# EAGLE design BMS_slave_Board_E14_itr2_ver3 (EAGLE 9.6.2)
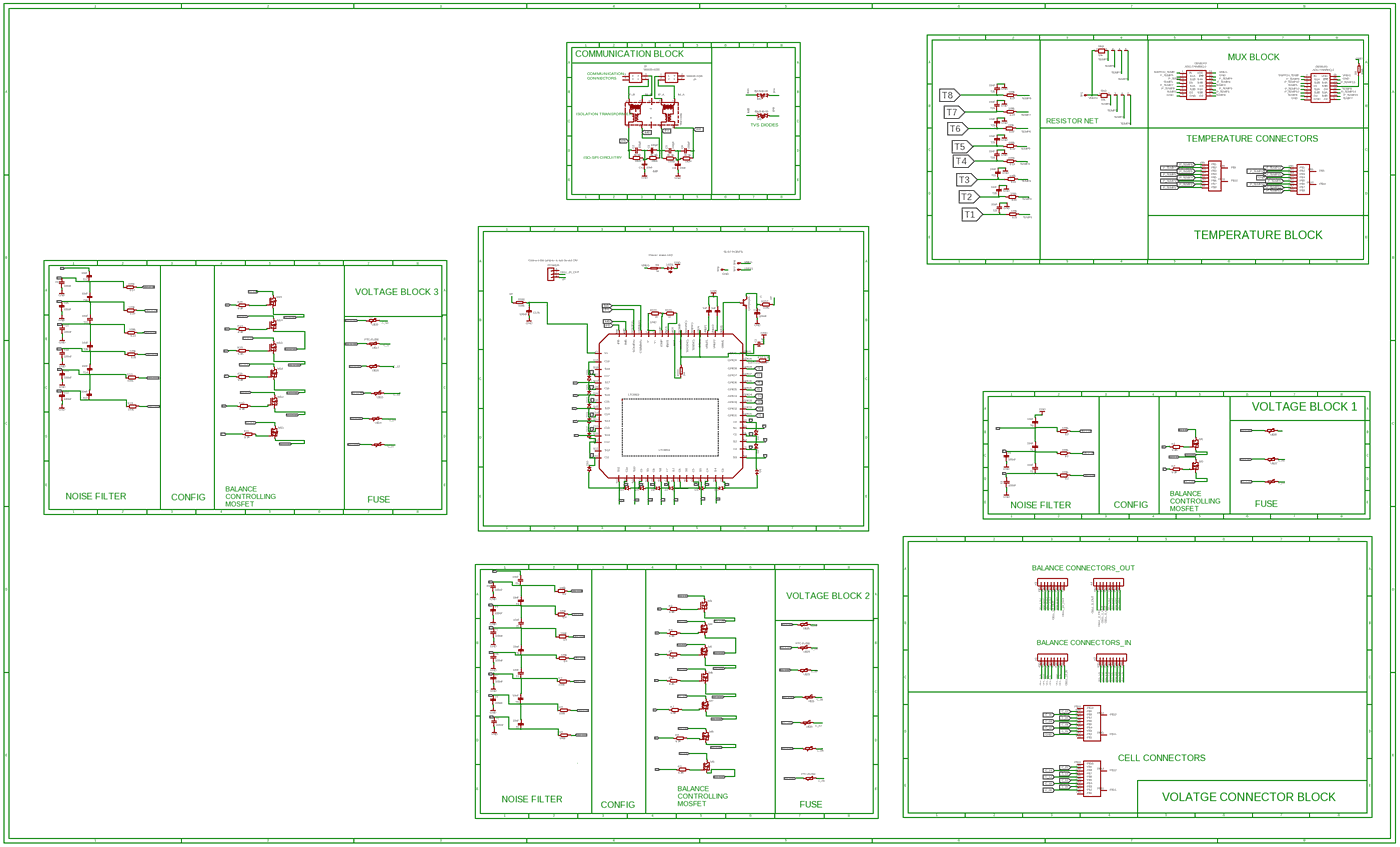
[diagram p0: schematic, sheet 1, overview]
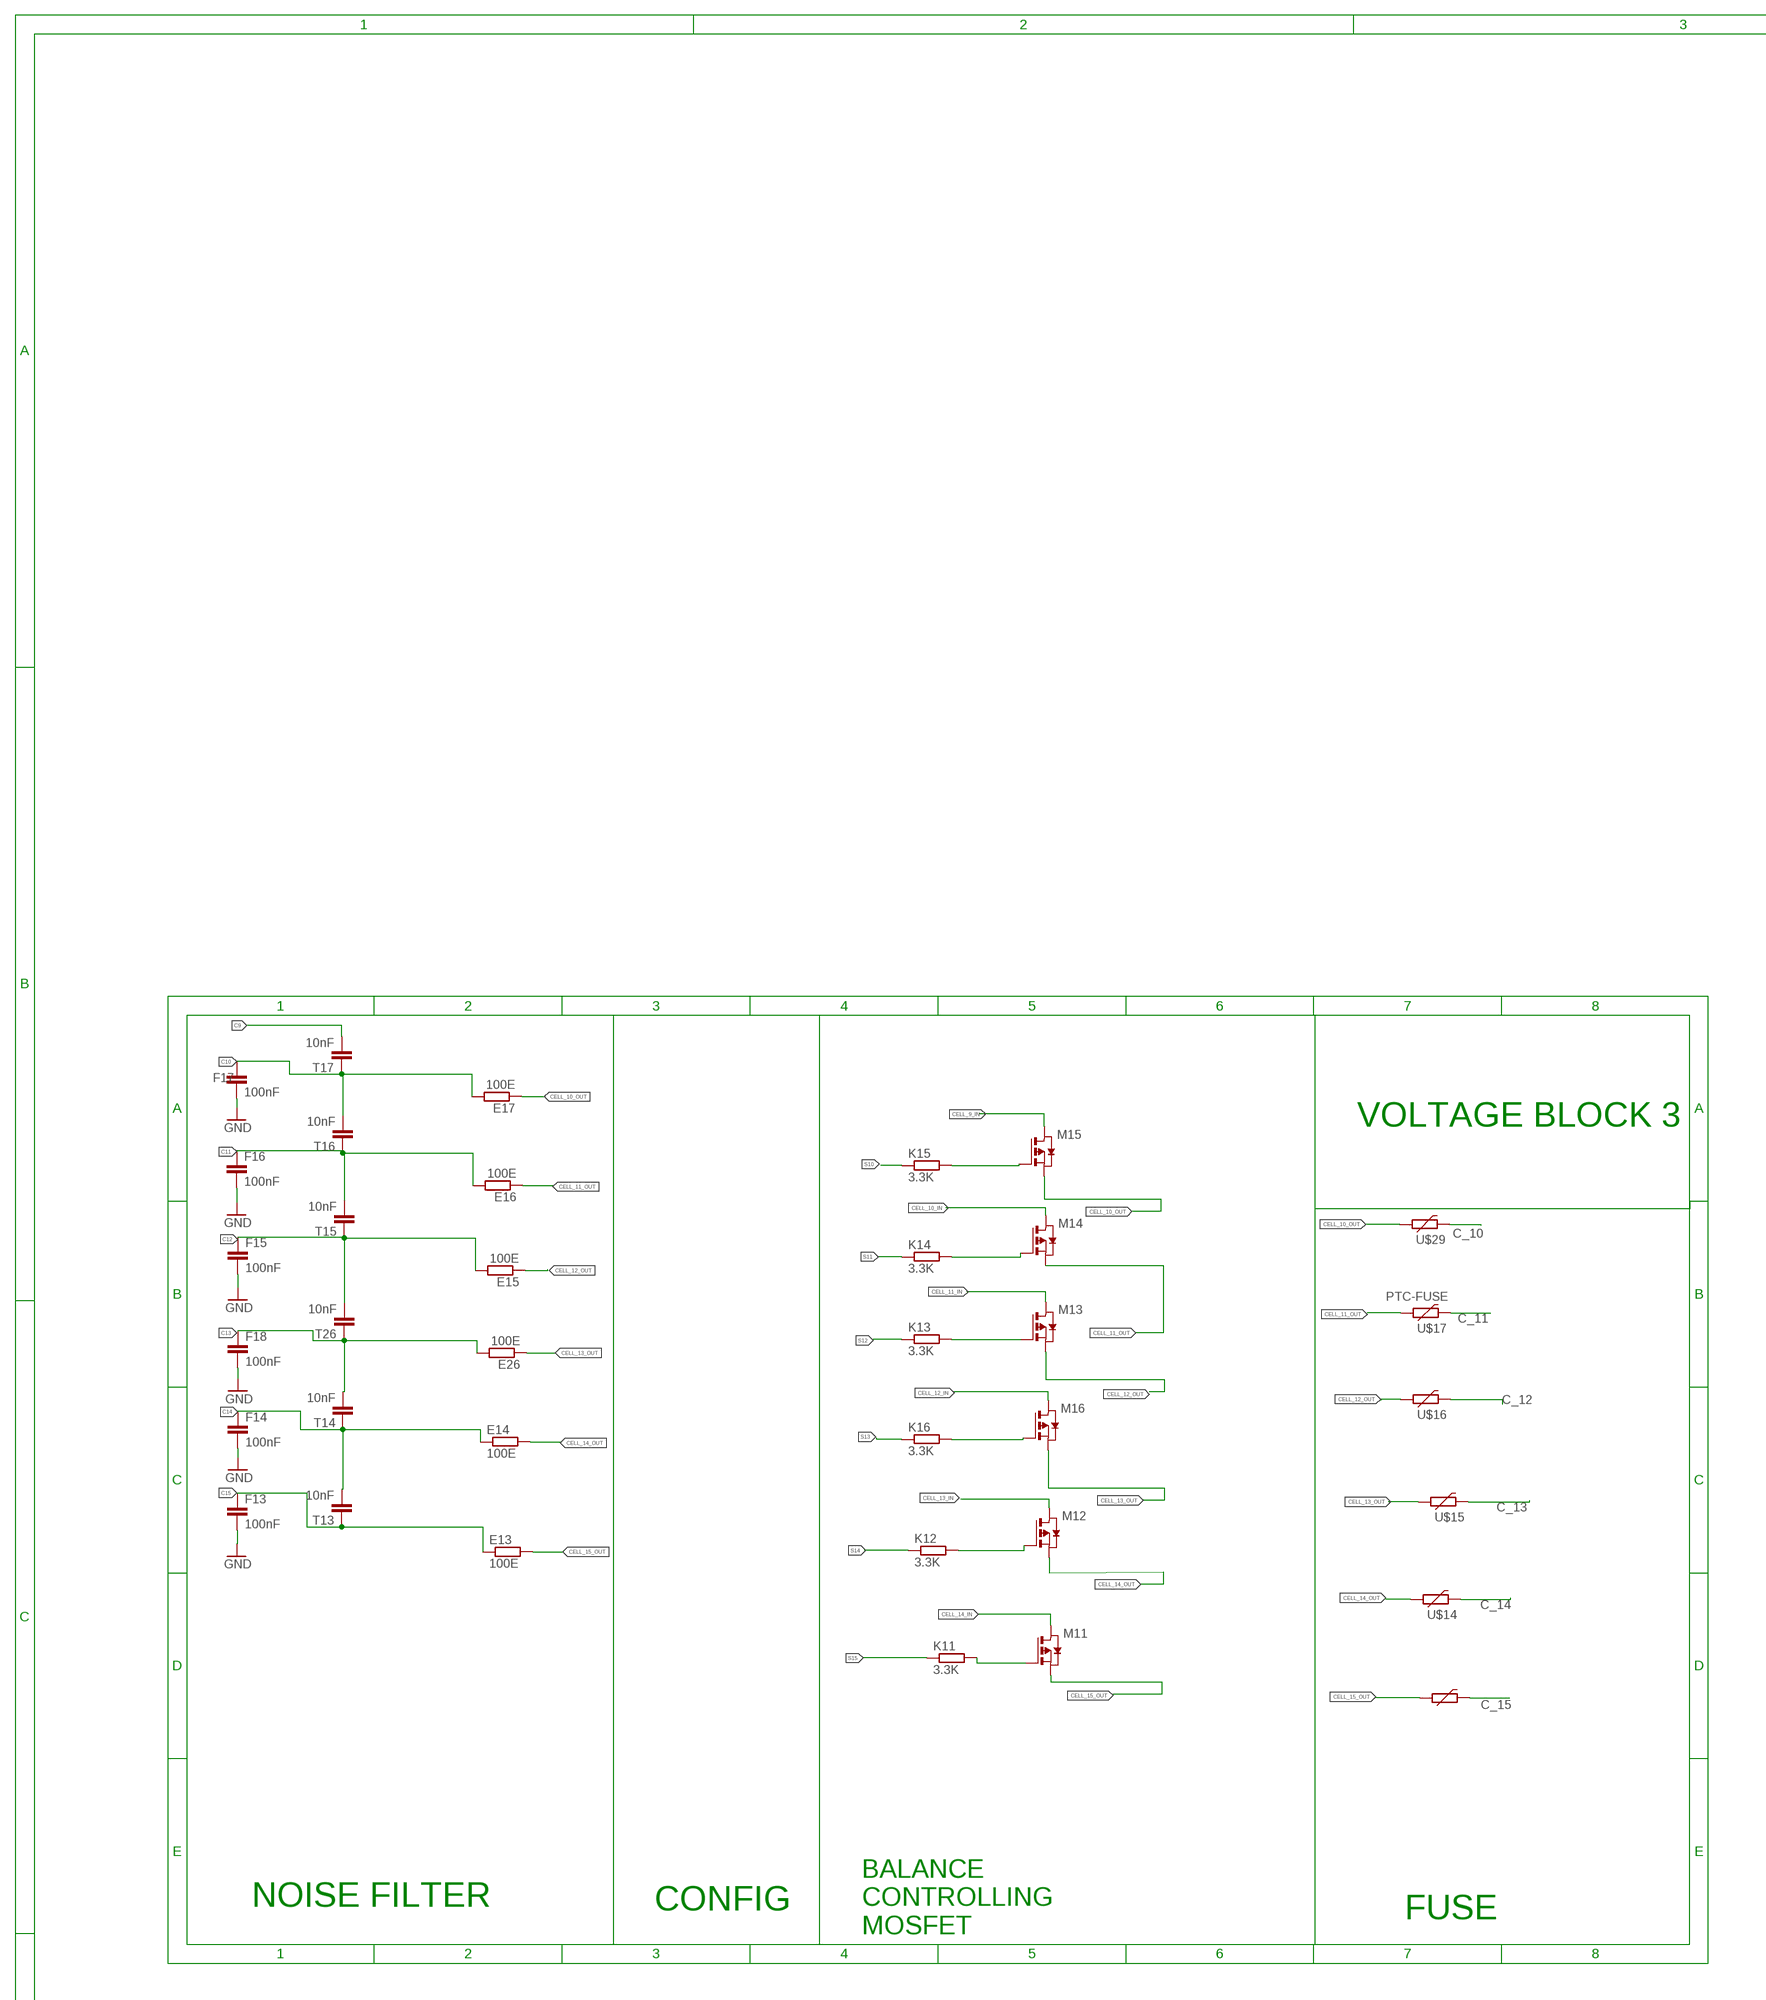
[diagram p1: schematic, sheet 1, part 1 of 6]
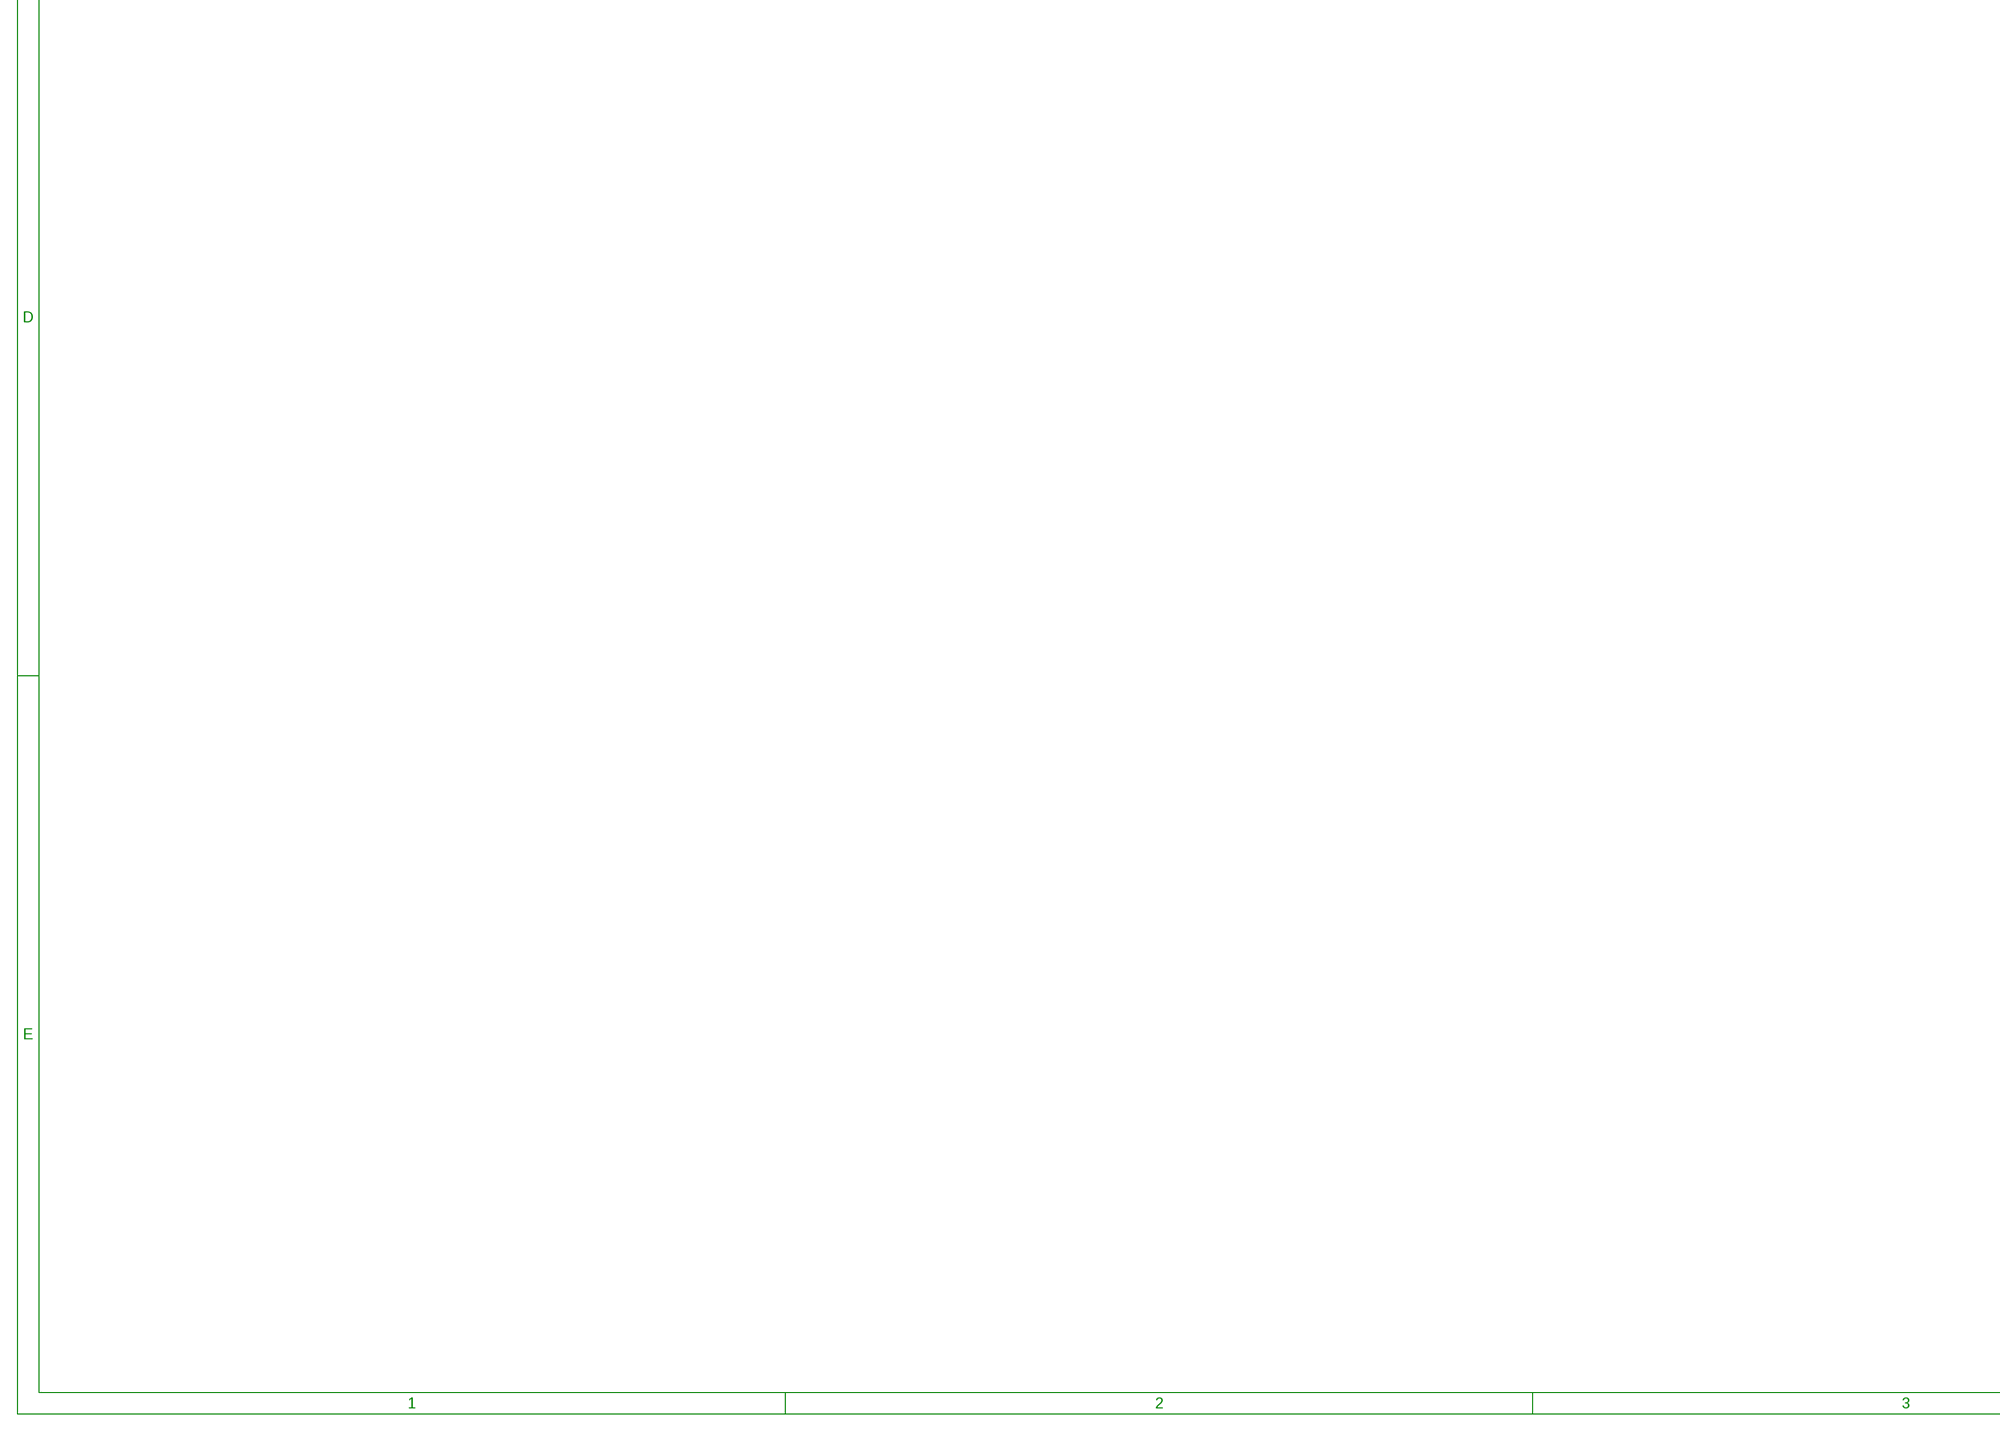
[diagram p2: schematic, sheet 1, part 2 of 6]
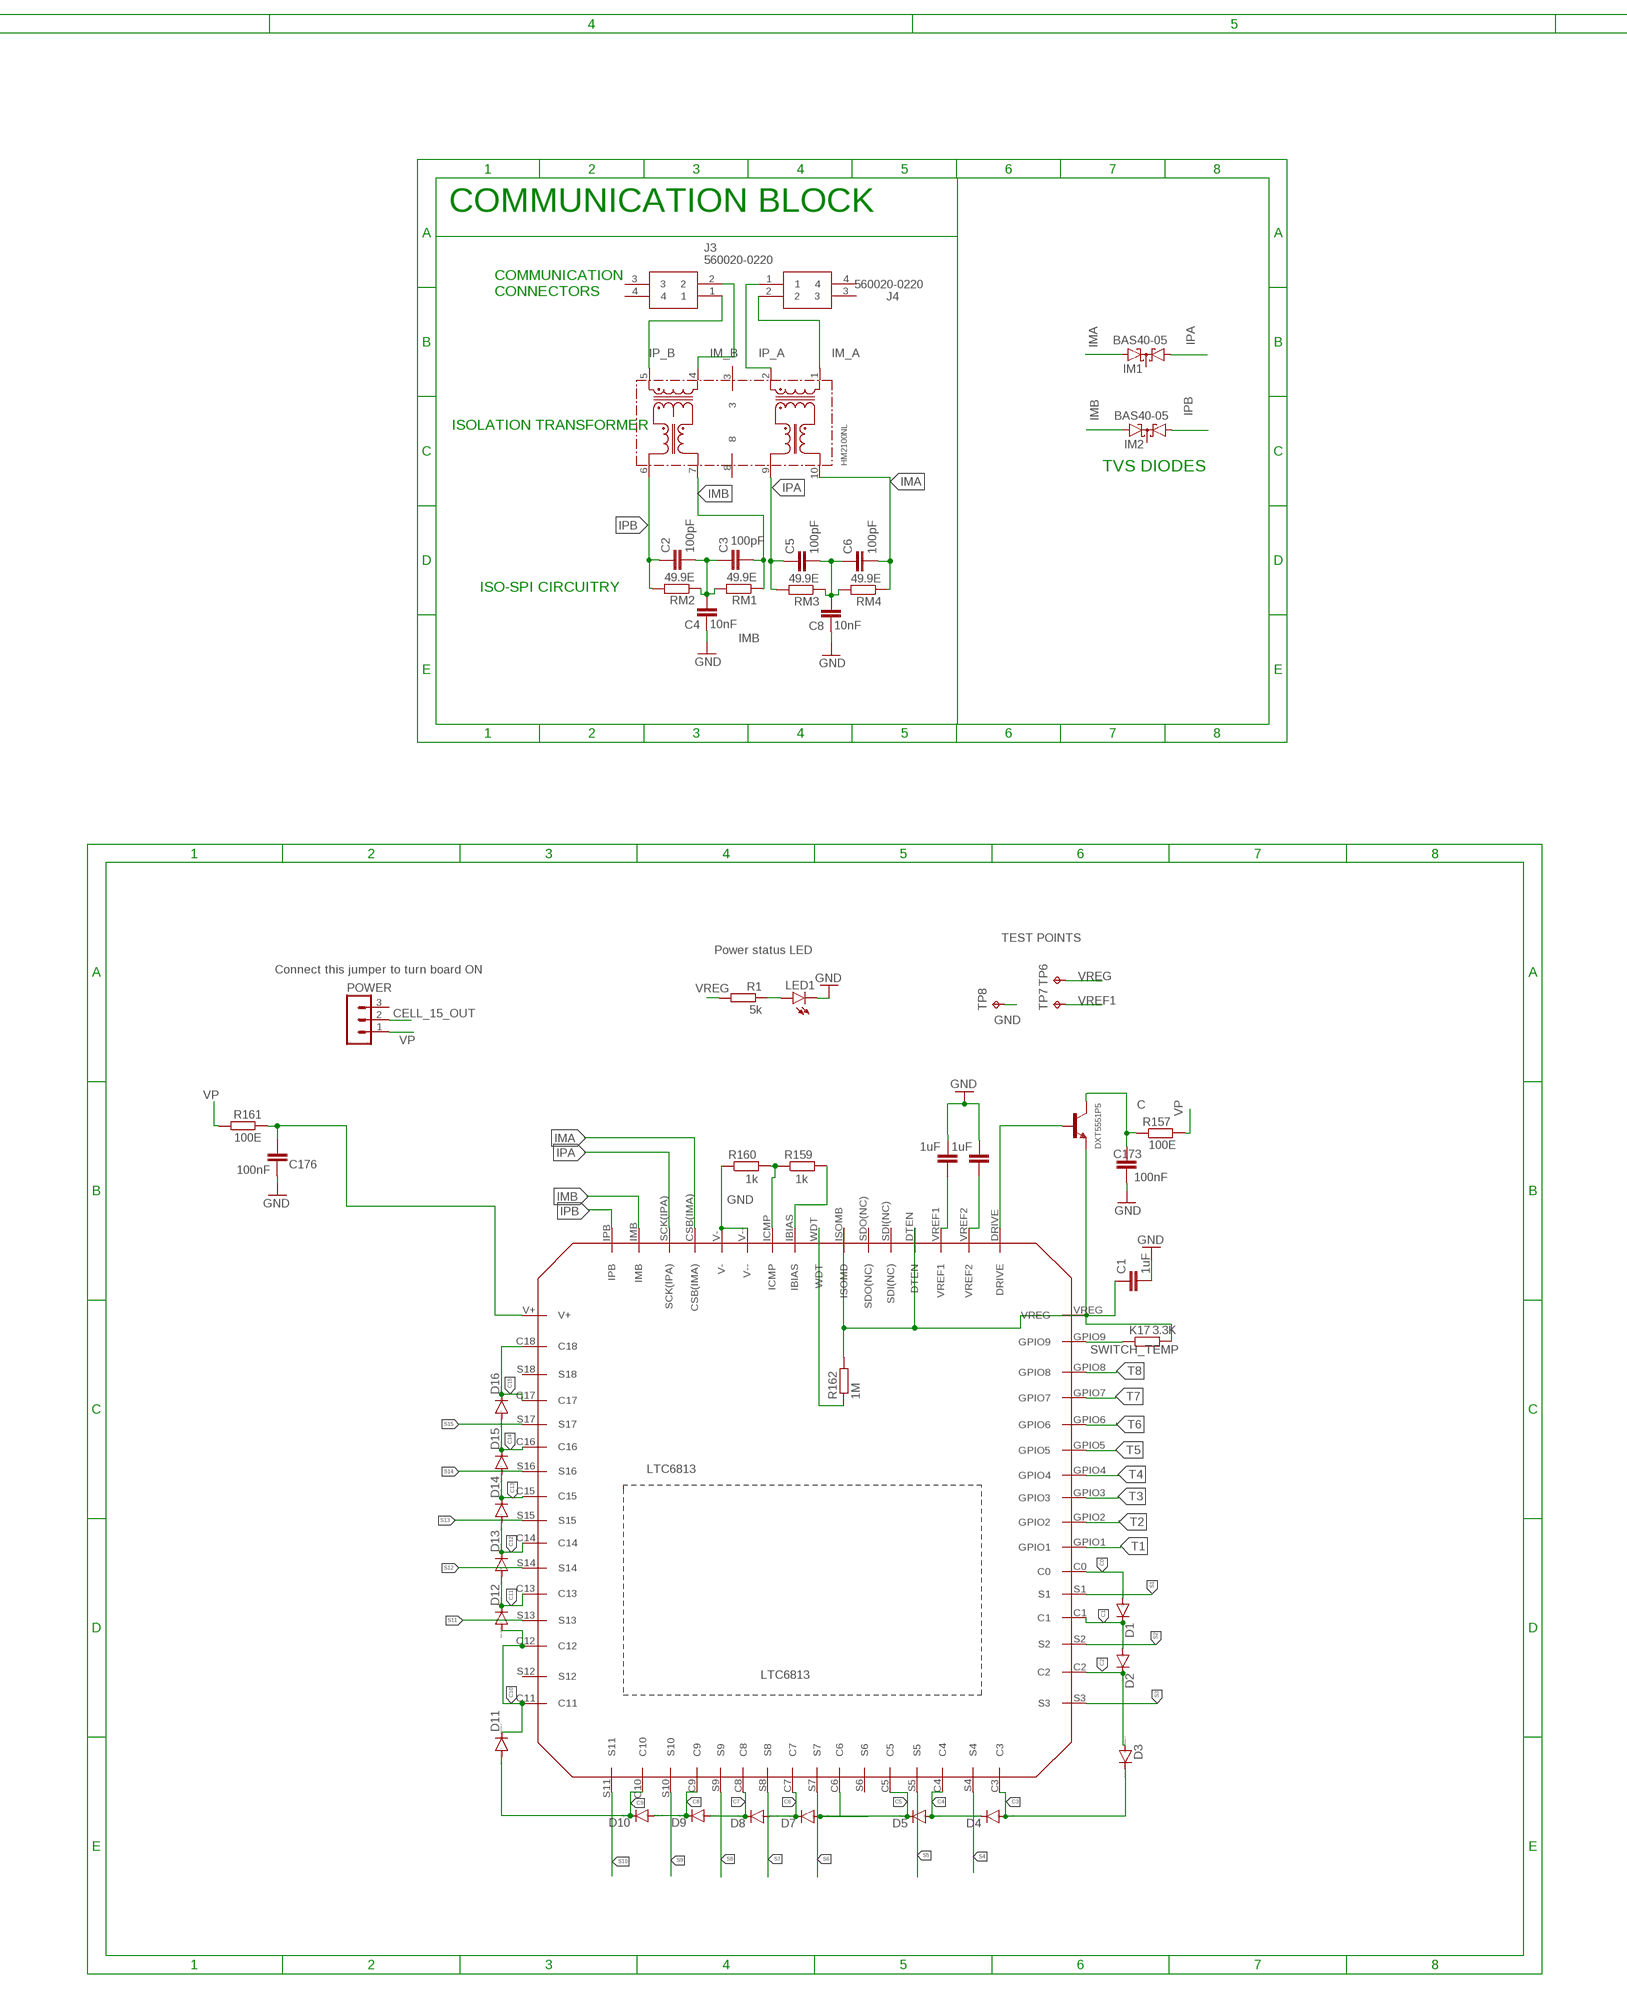
[diagram p3: schematic, sheet 1, part 3 of 6]
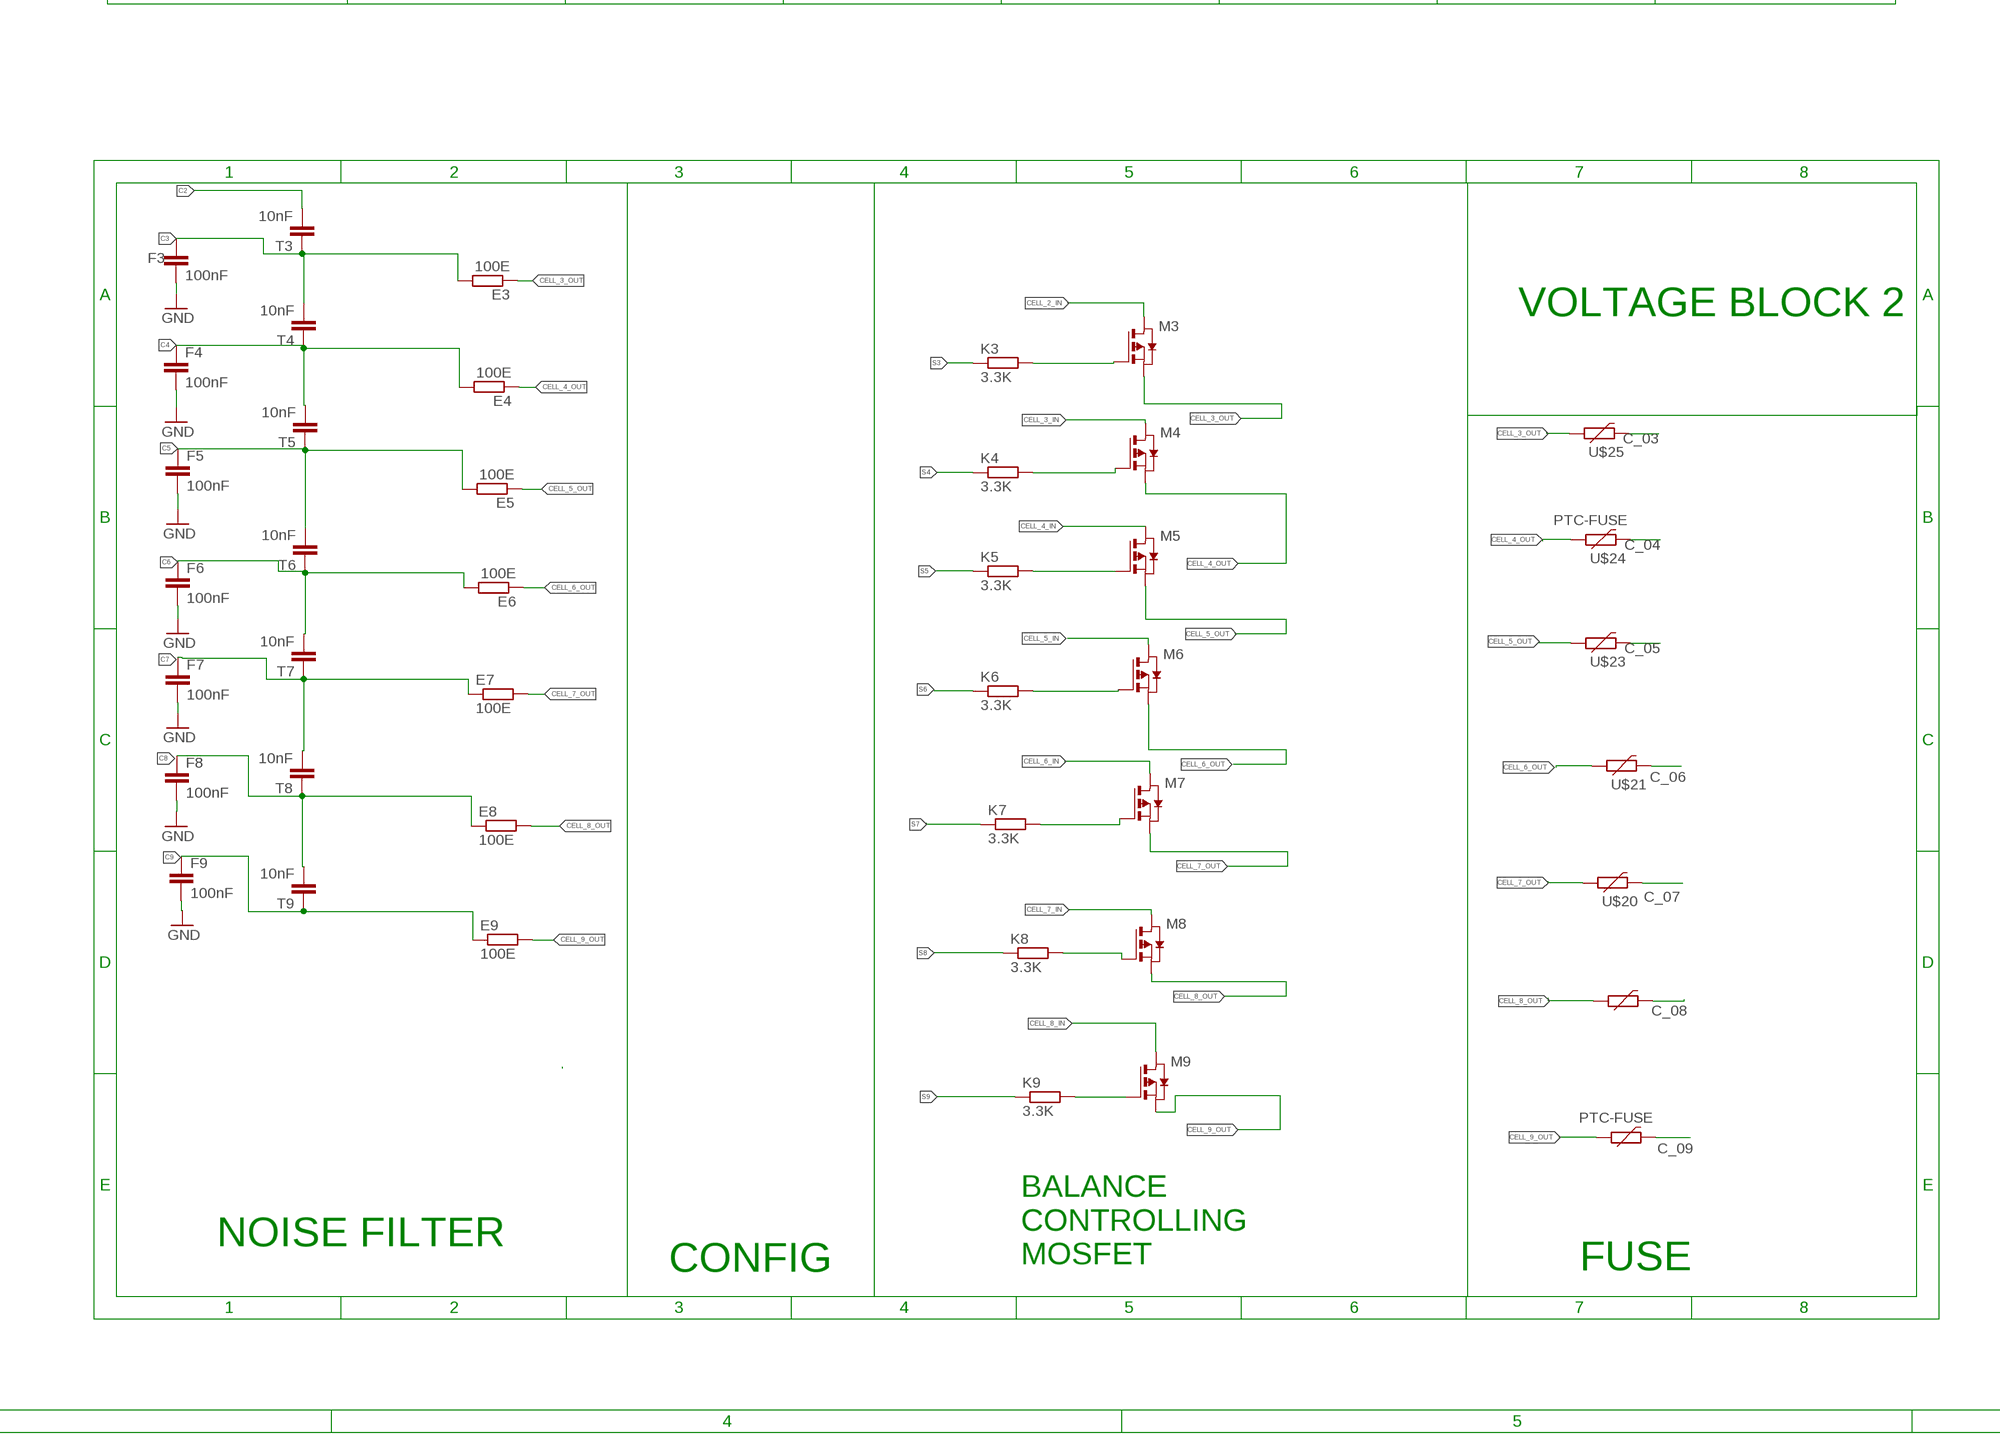
[diagram p4: schematic, sheet 1, part 4 of 6]
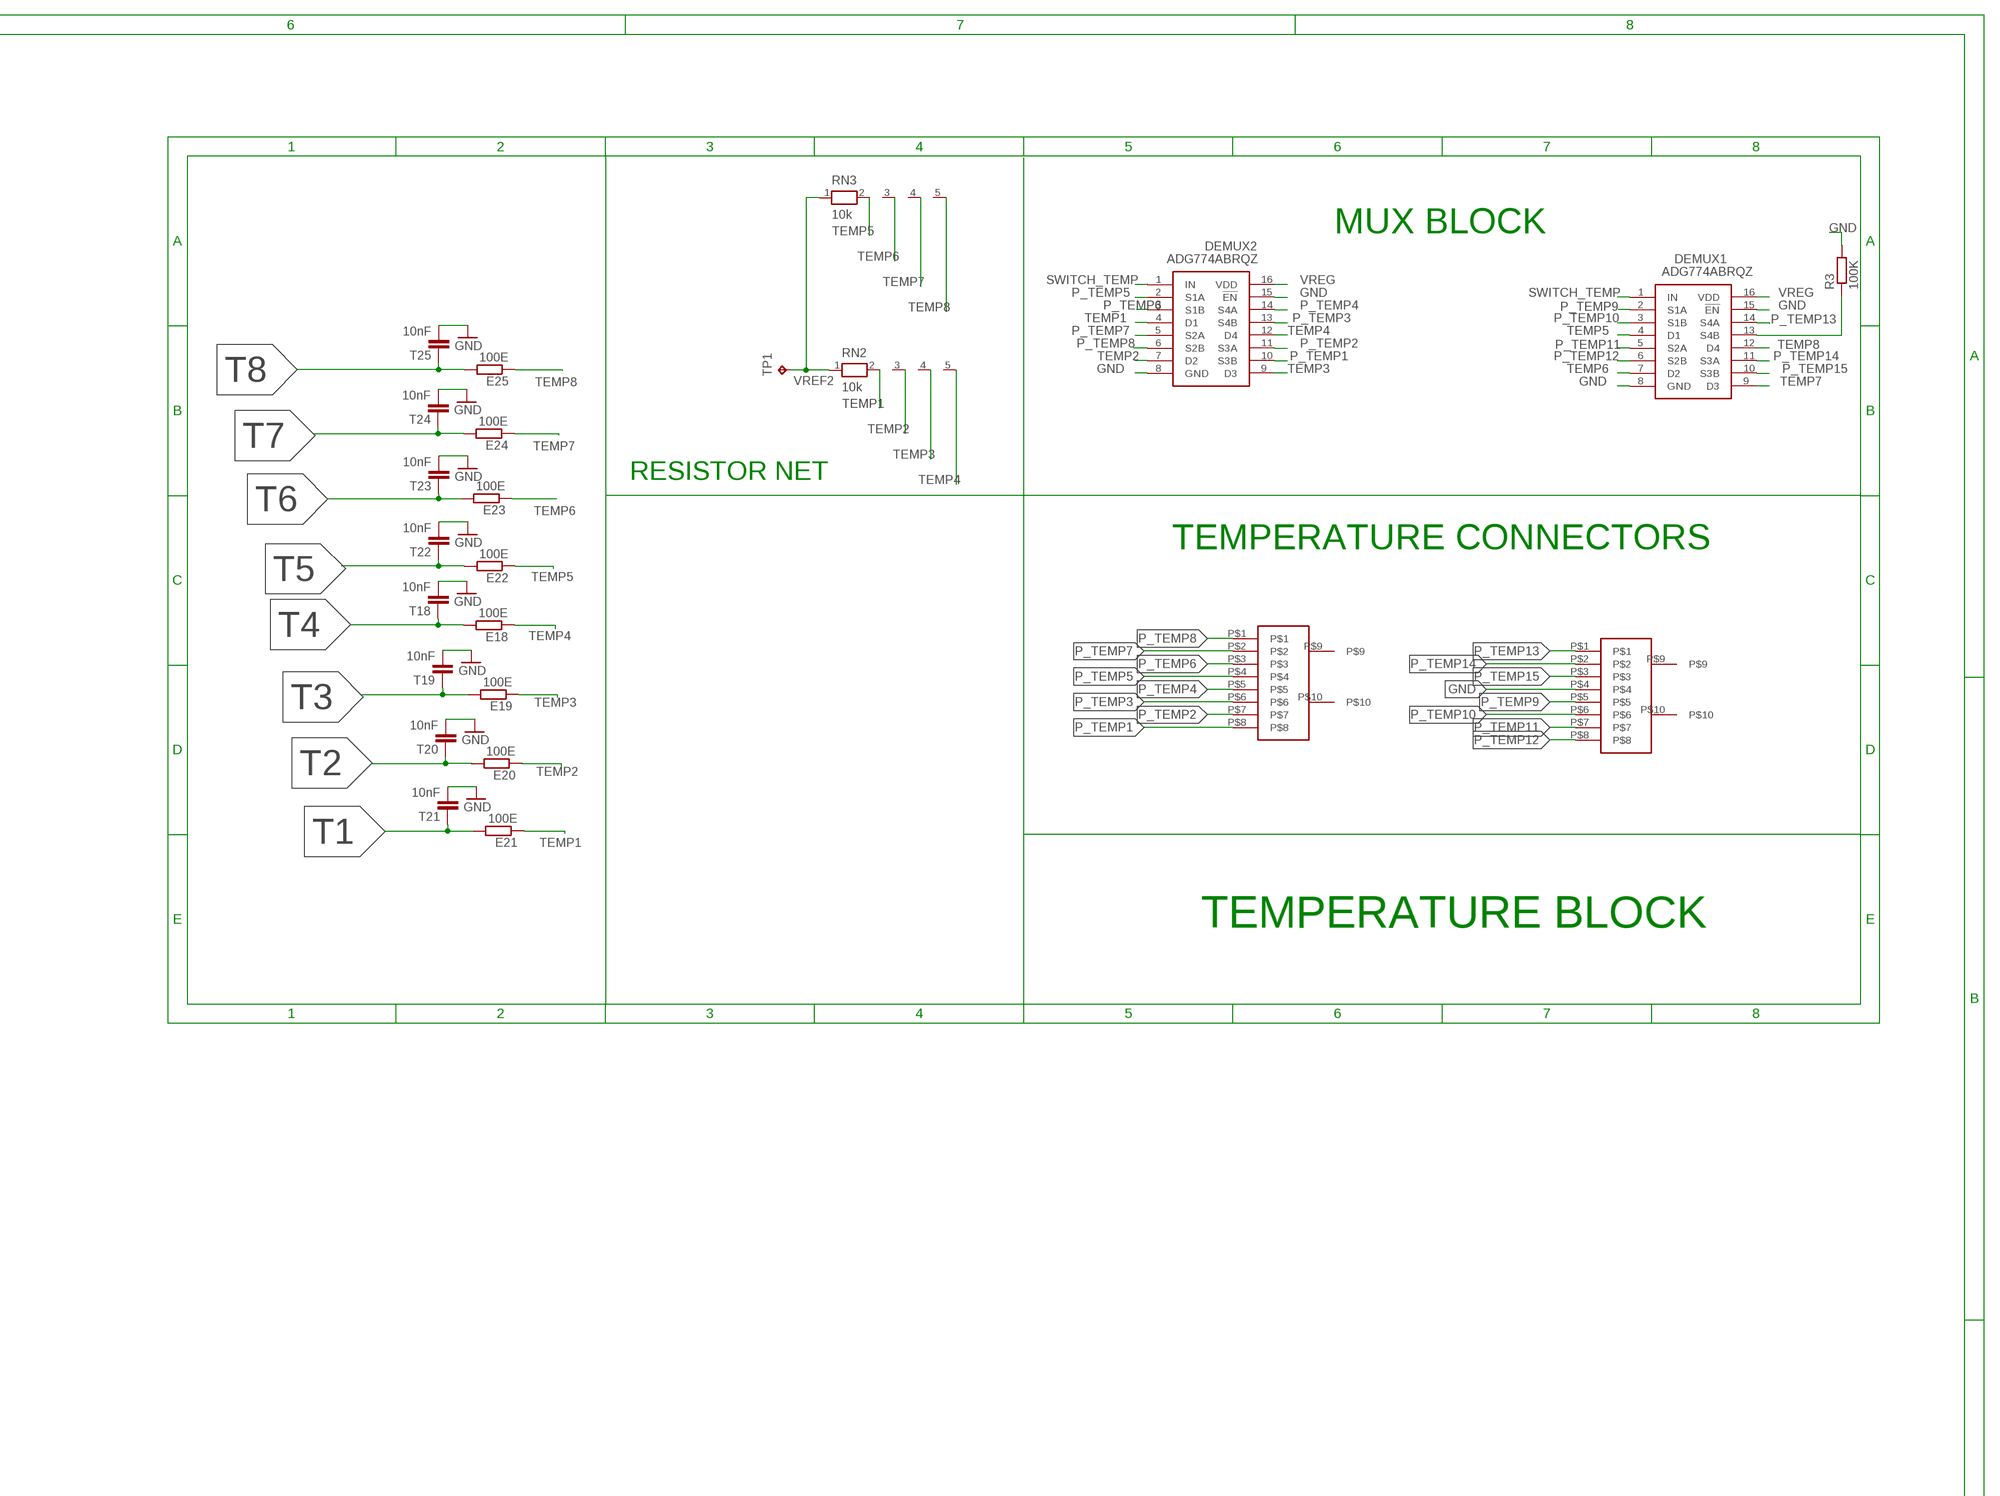
[diagram p5: schematic, sheet 1, part 5 of 6]
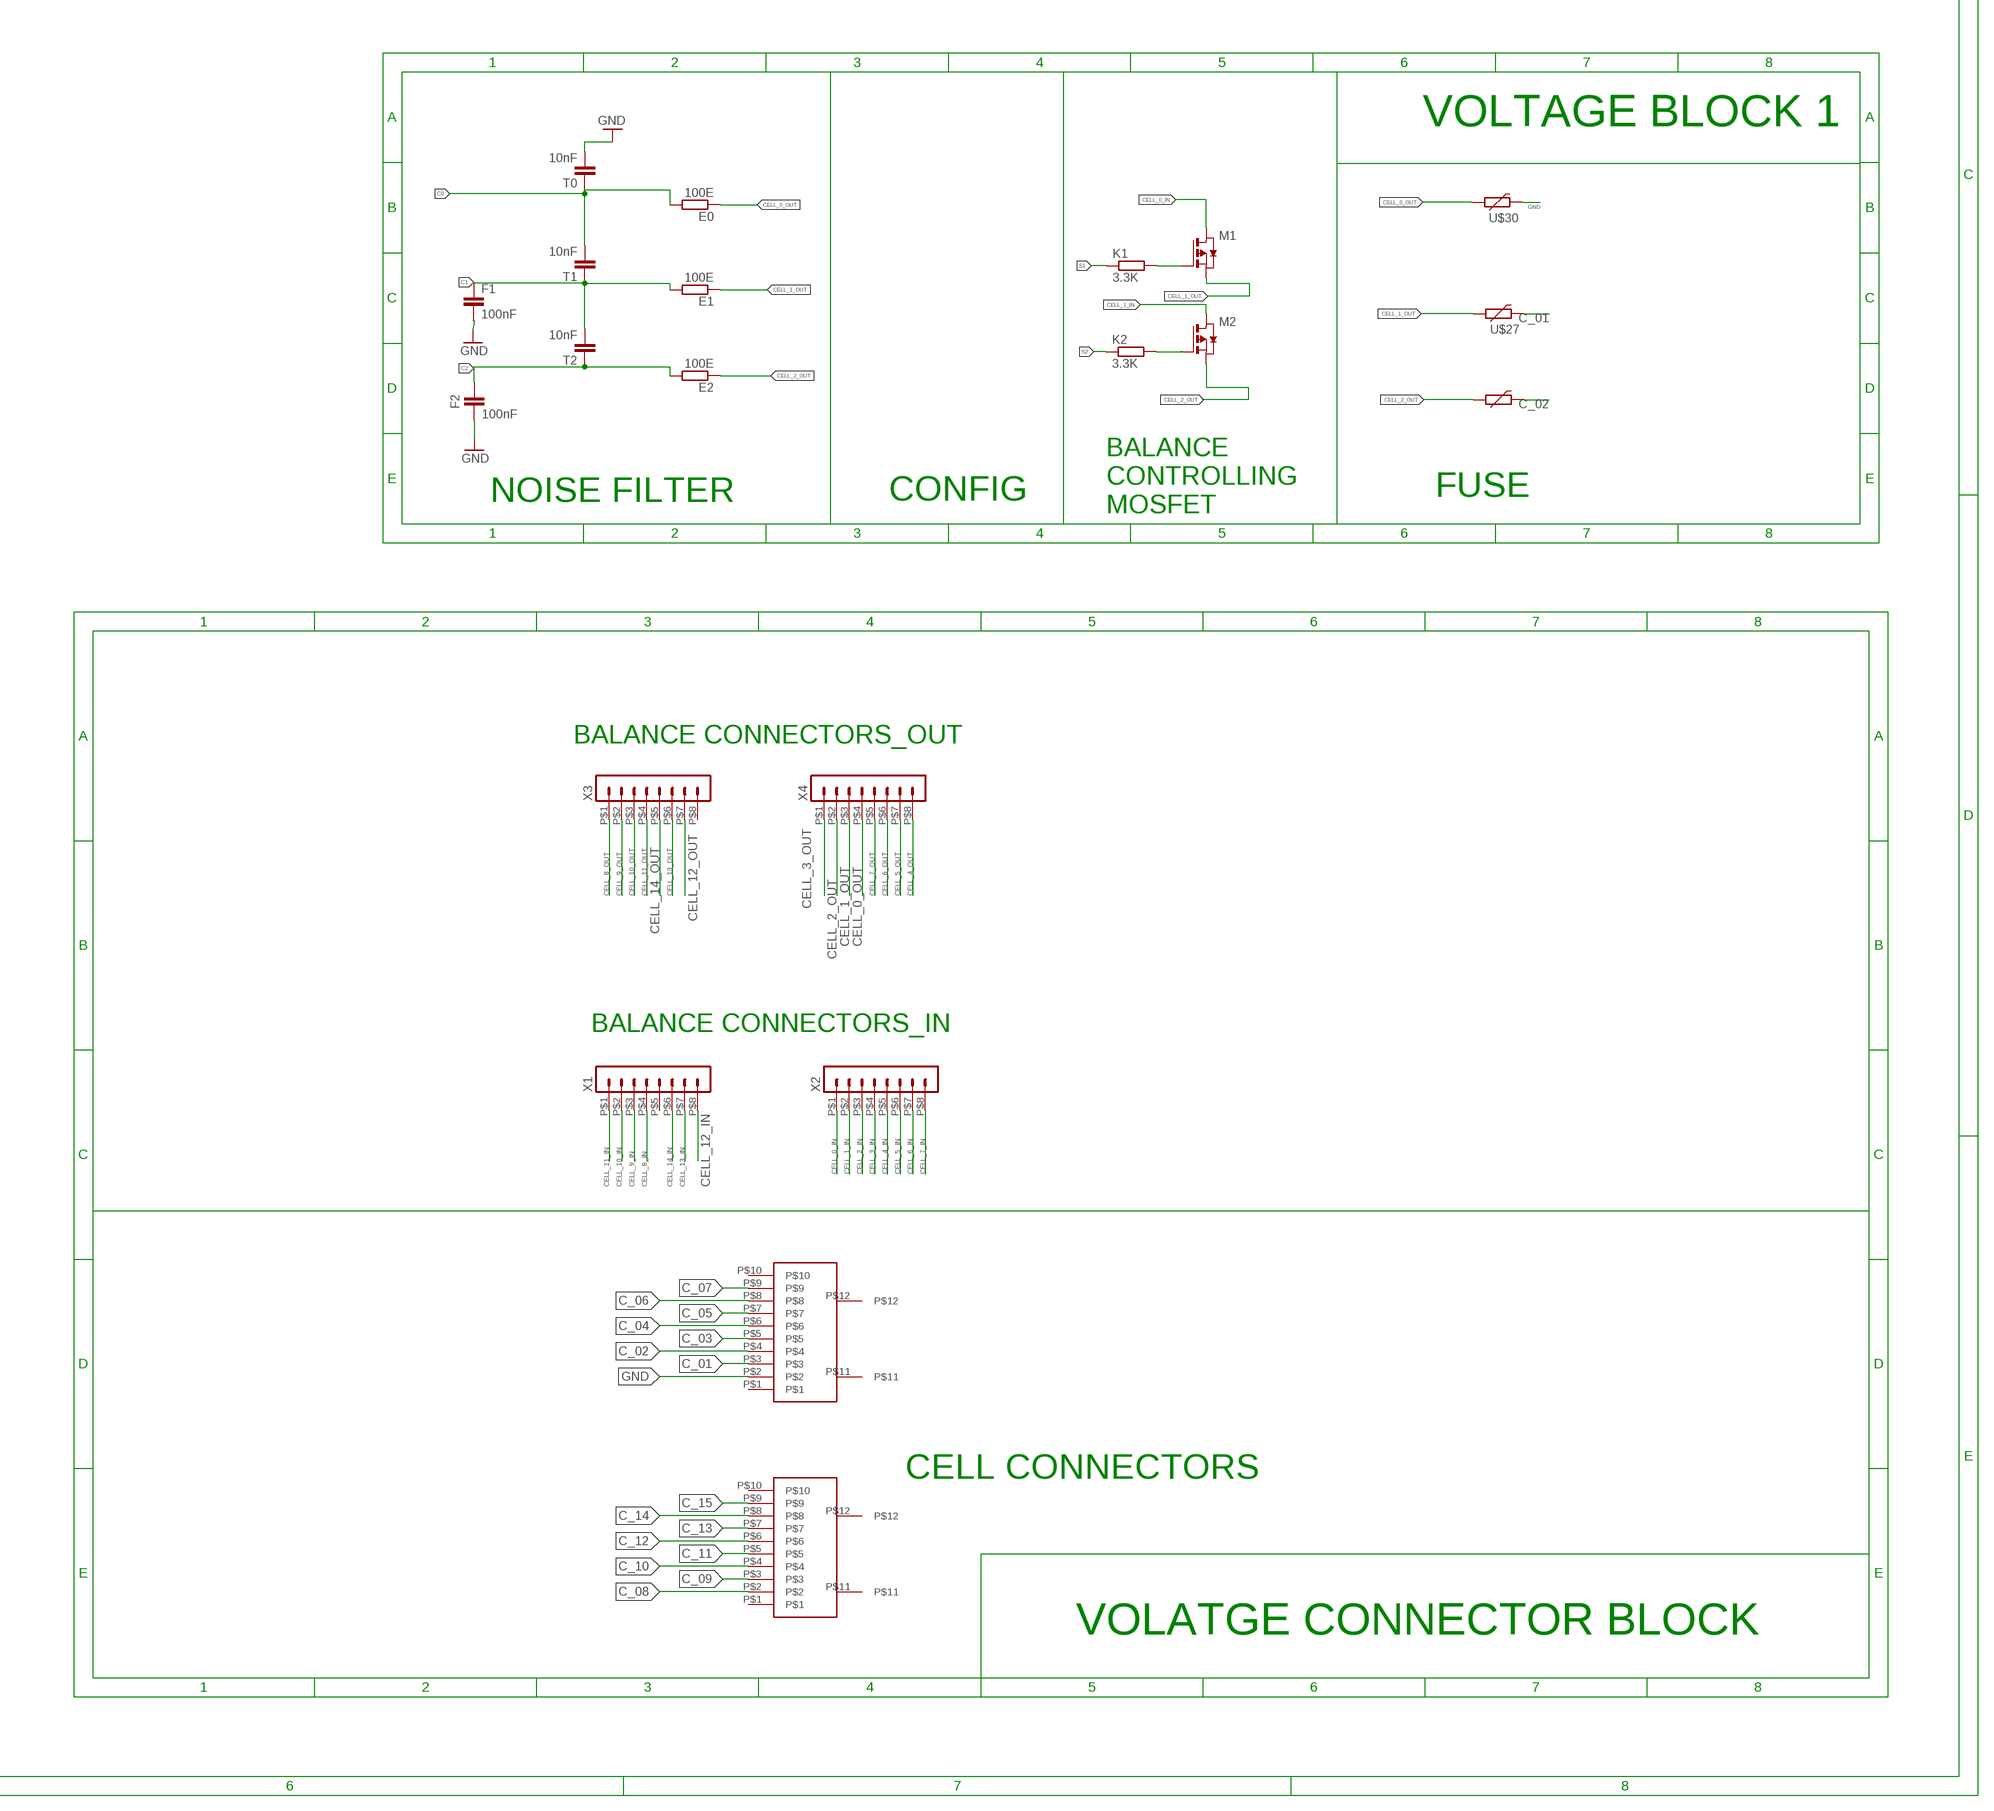
[diagram p6: schematic, sheet 1, part 6 of 6]

## Parts
C1  1uF  C-EUC0805  [C0805]
C2  100pF  C-EUC0603  [C0603]
C3  100pF  C-EUC0603  [C0603]
C4  10nF  C-EUC0603  [C0603]
C5  100pF  C-EUC0603  [C0603]
C6  100pF  C-EUC0603  [C0603]
C8  10nF  C-EUC0603  [C0603]
C173  100nF  C-EUC0805  [C0805]
C175  1uF  C-EUC0805  [C0805]
C176  100nF  C-EUC0805  [C0805]
C177  1uF  C-EUC0805  [C0805]
D1  DIODE-SOD123  [SOD123]
D2  DIODE-SOD123  [SOD123]
D3  DIODE-SOD123  [SOD123]
D4  DIODE-SOD123  [SOD123]
D5  DIODE-SOD123  [SOD123]
D7  DIODE-SOD123  [SOD123]
D8  DIODE-SOD123  [SOD123]
D9  DIODE-SOD123  [SOD123]
D10  DIODE-SOD123  [SOD123]
D11  DIODE-SOD123  [SOD123]
D12  DIODE-SOD123  [SOD123]
D13  DIODE-SOD123  [SOD123]
D14  DIODE-SOD123  [SOD123]
D15  DIODE-SOD123  [SOD123]
D16  DIODE-SOD123  [SOD123]
DEMUX1  ADG774ABRQZ  [SOP64P600X175-16N]
DEMUX2  ADG774ABRQZ  [SOP64P600X175-16N]
E0  100E  R-EU_R0603  [R0603]
E1  100E  R-EU_R0603  [R0603]
E2  100E  R-EU_R0603  [R0603]
E3  100E  R-EU_R0603  [R0603]
E4  100E  R-EU_R0603  [R0603]
E5  100E  R-EU_R0603  [R0603]
E6  100E  R-EU_R0603  [R0603]
E7  100E  R-EU_R0603  [R0603]
E8  100E  R-EU_R0603  [R0603]
E9  100E  R-EU_R0603  [R0603]
E13  100E  R-EU_R0603  [R0603]
E14  100E  R-EU_R0603  [R0603]
E15  100E  R-EU_R0603  [R0603]
E16  100E  R-EU_R0603  [R0603]
E17  100E  R-EU_R0603  [R0603]
E18  100E  R-EU_R0603  [R0603]
E19  100E  R-EU_R0603  [R0603]
E20  100E  R-EU_R0603  [R0603]
E21  100E  R-EU_R0603  [R0603]
E22  100E  R-EU_R0603  [R0603]
E23  100E  R-EU_R0603  [R0603]
E24  100E  R-EU_R0603  [R0603]
E25  100E  R-EU_R0603  [R0603]
E26  100E  R-EU_R0603  [R0603]
F1  100nF  C-EUC1206  [C1206]
F2  100nF  C-EUC1206  [C1206]
F3  100nF  C-EUC1206  [C1206]
F4  100nF  C-EUC1206  [C1206]
F5  100nF  C-EUC1206  [C1206]
F6  100nF  C-EUC1206  [C1206]
F7  100nF  C-EUC1206  [C1206]
F8  100nF  C-EUC1206  [C1206]
F9  100nF  C-EUC1206  [C1206]
F13  100nF  C-EUC1206  [C1206]
F14  100nF  C-EUC1206  [C1206]
F15  100nF  C-EUC1206  [C1206]
F16  100nF  C-EUC1206  [C1206]
F17  100nF  C-EUC1206  [C1206]
F18  100nF  C-EUC1206  [C1206]
IM1  BAS40-05  [SOT23]
IM2  BAS40-05  [SOT23]
J3  560020-0220  [5600200220]
J4  560020-0220  [5600200220]
K1  3.3K  R-EU_R0603  [R0603]
K2  3.3K  R-EU_R0603  [R0603]
K3  3.3K  R-EU_R0603  [R0603]
K4  3.3K  R-EU_R0603  [R0603]
K5  3.3K  R-EU_R0603  [R0603]
K6  3.3K  R-EU_R0603  [R0603]
K7  3.3K  R-EU_R0603  [R0603]
K8  3.3K  R-EU_R0603  [R0603]
K9  3.3K  R-EU_R0603  [R0603]
K11  3.3K  R-EU_R0603  [R0603]
K12  3.3K  R-EU_R0603  [R0603]
K13  3.3K  R-EU_R0603  [R0603]
K14  3.3K  R-EU_R0603  [R0603]
K15  3.3K  R-EU_R0603  [R0603]
K16  3.3K  R-EU_R0603  [R0603]
K17  3.3K  R-EU_R0603  [R0603]
LED1  LEDSMT1206  [1206]
M1  PMOSSOT23  [SOT-23]
M2  PMOSSOT23  [SOT-23]
M3  PMOSSOT23  [SOT-23]
M4  PMOSSOT23  [SOT-23]
M5  PMOSSOT23  [SOT-23]
M6  PMOSSOT23  [SOT-23]
M7  PMOSSOT23  [SOT-23]
M8  PMOSSOT23  [SOT-23]
M9  PMOSSOT23  [SOT-23]
M11  PMOSSOT23  [SOT-23]
M12  PMOSSOT23  [SOT-23]
M13  PMOSSOT23  [SOT-23]
M14  PMOSSOT23  [SOT-23]
M15  PMOSSOT23  [SOT-23]
M16  PMOSSOT23  [SOT-23]
POWER  MA03-1  [MA03-1]
R1  5k  R-EU_R0805  [R0805]
R3  100K  R-EU_R0805  [R0805]
R157  100E  R-EU_R0805  [R0805]
R159  1k  R-EU_R0805  [R0805]
R160  1k  R-EU_R0805  [R0805]
R161  100E  R-EU_R0805  [R0805]
R162  1M  R-EU_R0805  [R0805]
RM1  49.9E  R-EU_R0603  [R0603]
RM2  49.9E  R-EU_R0603  [R0603]
RM3  49.9E  R-EU_R0603  [R0603]
RM4  49.9E  R-EU_R0603  [R0603]
RN2  10k  RN04  [RN-5]
RN3  10k  RN04  [RN-5]
T0  10nF  C-EUC0603  [C0603]
T1  10nF  C-EUC0603  [C0603]
T2  10nF  C-EUC0603  [C0603]
T3  10nF  C-EUC0603  [C0603]
T4  10nF  C-EUC0603  [C0603]
T5  10nF  C-EUC0603  [C0603]
T6  10nF  C-EUC0603  [C0603]
T7  10nF  C-EUC0603  [C0603]
T8  10nF  C-EUC0603  [C0603]
T9  10nF  C-EUC0603  [C0603]
T13  10nF  C-EUC0603  [C0603]
T14  10nF  C-EUC0603  [C0603]
T15  10nF  C-EUC0603  [C0603]
T16  10nF  C-EUC0603  [C0603]
T17  10nF  C-EUC0603  [C0603]
T18  10nF  C-EUC0603  [C0603]
T19  10nF  C-EUC0603  [C0603]
T20  10nF  C-EUC0603  [C0603]
T21  10nF  C-EUC0603  [C0603]
T22  10nF  C-EUC0603  [C0603]
T23  10nF  C-EUC0603  [C0603]
T24  10nF  C-EUC0603  [C0603]
T25  10nF  C-EUC0603  [C0603]
T26  10nF  C-EUC0603  [C0603]
TP1  TPPAD1-13  [P1-13]
TP6  TPPAD1-13  [P1-13]
TP7  TPPAD1-13  [P1-13]
TP8  TPPAD1-13  [P1-13]
U$1  HM2100NL  [HM2100NL]
U$2  DXT5551P5  [DXT5551P5]
U$3  LTC6813  [LTC6813]
U$8  VERTICALBMS8  [VERTICALBMS8]
U$9  VERTICALBMS8  [VERTICALBMS8]
U$10  VERTICALBMS10  [VERTICALBMS10]
U$11  VERTICALBMS10  [VERTICALBMS10]
U$13  PTC-FUSE  [1206]
U$14  PTC-FUSE  [1206]
U$15  PTC-FUSE  [1206]
U$16  PTC-FUSE  [1206]
U$17  PTC-FUSE  [1206]
U$18  PTC-FUSE  [1206]
U$19  PTC-FUSE  [1206]
U$20  PTC-FUSE  [1206]
U$21  PTC-FUSE  [1206]
U$23  PTC-FUSE  [1206]
U$24  PTC-FUSE  [1206]
U$25  PTC-FUSE  [1206]
U$26  PTC-FUSE  [1206]
U$27  PTC-FUSE  [1206]
U$29  PTC-FUSE  [1206]
U$30  PTC-FUSE  [1206]
X1  HEADER_POS8_44914-0801  [44914-0801]
X2  HEADER_POS8_44914-0801  [44914-0801]
X3  HEADER_POS8_44914-0801  [44914-0801]
X4  HEADER_POS8_44914-0801  [44914-0801]

## Nets
C: C173.1 R157.1 U$2.C
C0: D1.A E0.2 T0.1 T1.2 U$3.C0
C1: D1.C D2.A E1.2 F1.1 T1.1 T2.2 U$3.C1
C2: D2.C D3.A E2.2 F2.1 T2.1 T3.2 U$3.C2
C3: D3.C D4.A E3.2 F3.1 T3.1 T4.2 U$3.C3
C4: D4.C D5.A E4.2 F4.1 T4.1 T5.2 U$3.C4
C5: D5.C D7.A E5.2 F5.1 T5.1 T6.2 U$3.C5 U$3.C6
C6: D7.C D8.A E6.2 F6.1 T6.1 T7.2 U$3.C7
C7: D8.C D9.A E7.1 F7.1 T7.1 T8.2 U$3.C8
C8: D9.C D10.A E8.1 F8.1 T8.1 T9.2 U$3.C9
C9: D10.C D11.A E9.1 F9.1 T9.1 T17.2 U$3.C10
C10: D11.C D12.A E17.2 F17.1 T16.2 T17.1 U$3.C11 U$3.C12
C11: D12.C D13.A E16.2 F16.1 T15.2 T16.1 U$3.C13
C12: D13.C D14.A E15.2 F15.1 T15.1 T26.2 U$3.C14
C13: D14.C D15.A E26.2 F18.1 T14.2 T26.1 U$3.C15
C14: D15.C D16.A E14.1 F14.1 T13.2 T14.1 U$3.C16
C15: D16.C E13.1 F13.1 T13.1 U$3.C17 U$3.C18
C_01: U$10.P$3 U$27.1
C_02: U$10.P$4 U$26.1
C_03: U$10.P$5 U$25.1
C_04: U$10.P$6 U$24.1
C_05: U$10.P$7 U$23.1
C_06: U$10.P$8 U$21.1
C_07: U$10.P$9 U$20.1
C_08: U$11.P$2 U$19.1
C_09: U$11.P$3 U$18.1
C_10: U$11.P$4 U$29.1
C_11: U$11.P$5 U$17.1
C_12: U$11.P$6 U$16.1
C_13: U$11.P$7 U$15.1
C_14: U$11.P$8 U$14.1
C_15: U$11.P$9 U$13.1
CELL_0_IN: M1.1(D) X2.P$1
CELL_0_OUT: E0.1 U$30.2 X4.P$4
CELL_1_IN: M2.1(D) X2.P$2
CELL_1_OUT: E1.1 M1.2(S) U$27.2 X4.P$3
CELL_2_IN: M3.1(D) X2.P$3
CELL_2_OUT: E2.1 M2.2(S) U$26.2 X4.P$2
CELL_3_IN: M4.1(D) X2.P$4
CELL_3_OUT: E3.1 M3.2(S) U$25.2 X4.P$1
CELL_4_IN: M5.1(D) X2.P$5
CELL_4_OUT: E4.1 M4.2(S) U$24.2 X4.P$8
CELL_5_IN: M6.1(D) X2.P$6
CELL_5_OUT: E5.1 M5.2(S) U$23.2 X4.P$7
CELL_6_IN: M7.1(D) X2.P$7
CELL_6_OUT: E6.1 M6.2(S) U$21.2 X4.P$6
CELL_7_IN: M8.1(D) X2.P$8
CELL_7_OUT: E7.2 M7.2(S) U$20.2 X4.P$5
CELL_8_IN: M9.1(D) X1.P$4
CELL_8_OUT: E8.2 M8.2(S) U$19.2 X3.P$1
CELL_9_IN: M15.1(D) X1.P$3
CELL_9_OUT: E9.2 M9.2(S) U$18.2 X3.P$2
CELL_10_IN: M14.1(D) X1.P$2
CELL_10_OUT: E17.1 M15.2(S) U$29.2 X3.P$3
CELL_11_IN: M13.1(D) X1.P$1
CELL_11_OUT: E16.1 M14.2(S) U$17.2 X3.P$4
CELL_12_IN: M16.1(D) X1.P$8
CELL_12_OUT: E15.1 M13.2(S) U$16.2 X3.P$7
CELL_13_IN: M12.1(D) X1.P$7
CELL_13_OUT: E26.1 M16.2(S) U$15.2 X3.P$6
CELL_14_IN: M11.1(D) X1.P$6
CELL_14_OUT: E14.2 M12.2(S) U$14.2 X3.P$5
CELL_15_OUT: E13.2 M11.2(S) POWER.2 U$13.2
GND: C1.2 C4.1 C8.1 C173.2 C175.2 C176.2 C177.2 DEMUX1.8(GND) DEMUX1.15(!EN) DEMUX2.8(GND) DEMUX2.15(!EN) F1.2 F2.2 F3.2 F4.2 F5.2 F6.2 F7.2 F8.2 F9.2 F13.2 F14.2 F15.2 F16.2 F17.2 F18.2 LED1.C R3.2 R160.1 T0.2 T18.2 T19.2 T20.2 T21.2 T22.2 T23.2 T24.2 T25.2 TP8.TP U$3.V- U$3.V-- U$9.P$4 U$10.P$2 U$30.1
IM_A: J4.2 U$1.1
IM_B: J3.2 U$1.4
IMA: C6.2 IM1.2(A2) RM4.1 U$1.10 U$3.CSB(IMA)
IMB: C3.2 IM2.2(A2) RM1.1 U$1.7 U$3.IMB
IP_A: J4.1 U$1.2
IP_B: J3.1 U$1.5
IPA: C5.1 IM1.1(A1) RM3.2 U$1.9 U$3.SCK(IPA)
IPB: C2.1 IM2.1(A1) RM2.2 U$1.6 U$3.IPB
N$3: C2.2 C3.1 C4.2 RM1.2 RM2.1
N$7: C5.2 C6.1 C8.2 RM3.1 RM4.2
N$8: R162.1 U$3.WDT
N$9: DEMUX1.13(S4B) R3.1
N$14: R159.1 R160.2 U$3.ICMP
N$19: K1.2 M1.3(G)
N$22: K2.2 M2.3(G)
N$25: K3.2 M3.3(G)
N$31: K4.2 M4.3(G)
N$37: K5.2 M5.3(G)
N$41: K6.2 M6.3(G)
N$43: K7.2 M7.3(G)
N$48: K16.2 M16.3(G)
N$50: K8.2 M8.3(G)
N$51: K9.2 M9.3(G)
N$63: K12.2 M12.3(G)
N$89: K15.2 M15.3(G)
N$91: K14.2 M14.3(G)
N$93: K13.2 M13.3(G)
N$95: K11.2 M11.3(G)
N$227: U$2.B U$3.DRIVE
N$241: R159.2 U$3.IBIAS
N$246: C176.1 R161.1 U$3.V+
P_TEMP1: DEMUX2.10(S3B) U$8.P$8
P_TEMP2: DEMUX2.11(S3A) U$8.P$7
P_TEMP3: DEMUX2.13(S4B) U$8.P$6
P_TEMP4: DEMUX2.14(S4A) U$8.P$5
P_TEMP5: DEMUX2.2(S1A) U$8.P$4
P_TEMP6: DEMUX2.3(S1B) U$8.P$3
P_TEMP7: DEMUX2.5(S2A) U$8.P$2
P_TEMP8: DEMUX2.6(S2B) U$8.P$1
P_TEMP9: DEMUX1.2(S1A) U$9.P$5
P_TEMP10: DEMUX1.3(S1B) U$9.P$6
P_TEMP11: DEMUX1.5(S2A) U$9.P$7
P_TEMP12: DEMUX1.6(S2B) U$9.P$8
P_TEMP13: DEMUX1.14(S4A) U$9.P$1
P_TEMP14: DEMUX1.11(S3A) U$9.P$2
P_TEMP15: DEMUX1.10(S3B) U$9.P$3
R: LED1.A R1.1
S1: K1.1 U$3.S1
S2: K2.1 U$3.S2
S3: K3.1 U$3.S3
S4: K4.1 U$3.S4
S5: K5.1 U$3.S5
S6: K6.1 U$3.S7
S7: K7.1 U$3.S8
S8: K8.1 U$3.S9
S9: K9.1 U$3.S10
S10: K15.1 U$3.S11
S11: K14.1 U$3.S13
S12: K13.1 U$3.S14
S13: K16.1 U$3.S15
S14: K12.1 U$3.S16
S15: K11.1 U$3.S17
SWITCH_TEMP: DEMUX1.1(IN) DEMUX2.1(IN) K17.1 U$3.GPIO9
T1: E21.2 T21.1 U$3.GPIO1
T2: E20.2 T20.1 U$3.GPIO2
T3: E19.2 T19.1 U$3.GPIO3
T4: E18.2 T18.1 U$3.GPIO4
T5: E22.2 T22.1 U$3.GPIO5
T6: E23.2 T23.1 U$3.GPIO6
T7: E24.2 T24.1 U$3.GPIO7
T8: E25.2 T25.1 U$3.GPIO8
TEMP1: DEMUX2.4(D1) E21.1 RN2.2
TEMP2: DEMUX2.7(D2) E20.1 RN2.3
TEMP3: DEMUX2.9(D3) E19.1 RN2.4
TEMP4: DEMUX2.12(D4) E18.1 RN2.5
TEMP5: DEMUX1.4(D1) E22.1 RN3.2
TEMP6: DEMUX1.7(D2) E23.1 RN3.3
TEMP7: DEMUX1.9(D3) E24.1 RN3.4
TEMP8: DEMUX1.12(D4) E25.1 RN3.5
VP: POWER.1 R157.2 R161.2
VREF1: C175.1 TP7.TP U$3.VREF1
VREF2: C177.1 RN2.1 RN3.1 TP1.TP U$3.VREF2
VREG: C1.1 DEMUX1.16(VDD) DEMUX2.16(VDD) K17.2 R1.2 R162.2 TP6.TP U$2.E U$3.DTEN U$3.ISOMB(ISOMD) U$3.VREG
Unconnected: IM1.3(C) IM2.3(C) J3.3 J3.4 J4.3 J4.4 POWER.3 U$1.3 U$1.8 U$3.S6 U$3.S12 U$3.S18 U$3.SDI(NC) U$3.SDO(NC) U$8.P$9 U$8.P$10 U$9.P$9 U$9.P$10 U$10.P$1 U$10.P$10 U$10.P$11 U$10.P$12 U$11.P$1 U$11.P$10 U$11.P$11 U$11.P$12 X1.P$5 X3.P$8

## Notes on the sheet
- COMMUNICATION BLOCK
- MUX BLOCK
- COMMUNICATION
  CONNECTORS
- ISOLATION TRANSFORMER
- RESISTOR NET
- TVS DIODES
- TEMPERATURE CONNECTORS
- ISO-SPI CIRCUITRY
- TEMPERATURE BLOCK
- TEST POINTS
- Power status LED
- Connect this jumper to turn board ON
- VOLTAGE BLOCK 3
- VOLTAGE BLOCK 1
- NOISE FILTER | CONFIG
- FUSE
- BALANCE
  CONTROLLING
  MOSFET
- NOISE FILTER | CONFIG | FUSE
- BALANCE
  CONTROLLING
  MOSFET
- BALANCE CONNECTORS_OUT
- VOLTAGE BLOCK 2
- BALANCE CONNECTORS_IN
- CELL CONNECTORS
- NOISE FILTER | VOLATGE CONNECTOR BLOCK
- BALANCE
  CONTROLLING
  MOSFET
- CONFIG | FUSE

## Library data of the parts
C1 C173 C175-C177 = IIT_BOMBAY_Racing:C-EU: CAPACITOR, European symbol
C2-C6 C8 T0 T1-T9 T13-T26 = resistor:C-EU: CAPACITOR, European symbol; MID: GCD188R71H103KA01D
D1-D5 D7-D16 = diode:DIODE-: DIODE
DEMUX1 DEMUX2 = SamacSys_Parts:ADG774ABRQZ: ADG774ABRQZ analogue switch, QSOP16 Analog Devices ADG774ABRQZ, Analogue Switch Quad 2:1, 3.3 V, 5 V, 16-Pin QSOP Source: Datasheet <http://www.analog.com/media/en/technical-documentation/data-sheets/ADG774A.pdf>; DESCRIPTION: ADG774ABRQZ analogue switch, QSOP16 Analog Devices ADG774ABRQZ, Analogue Switch Quad 2:1, 3.3 V, 5 V, 16-Pin QSOP; HEIGHT: 1.75mm; MANUFACTURER_NAME: Analog Devices; MANUFACTURER_PART_NUMBER: ADG774ABRQZ; MOUSER_PART_NUMBER: 584-ADG774ABRQZ; MOUSER_PRICE-STOCK: https://www.mouser.co.uk/ProductDetail/Analog-Devices/ADG774ABRQZ?qs=BpaRKvA4VqET7XGcXCMwIA%3D%3D
E0 E1-E9 E13-E26 = resistor:R-EU_: RESISTOR, European symbol; MID: MCT06030C1000FP500
F1-F9 F13-F18 = rcl:C-EU: CAPACITOR, European symbol; SPICEPREFIX: C
IM1 IM2 = diode:BAS40-05: Silicon Schottky Diodes General-purpose diode for high-speed switching
J3 J4 = 560020-0220:560020-0220: MOLEX - 560020-0220 - CONNECTOR, HEADER, 2POS, 1ROW, 2MM Source: Datasheet <https://www.molex.com/pdm_docs/sd/5600200220_sd.pdf>; DESCRIPTION: MOLEX - 560020-0220 - CONNECTOR, HEADER, 2POS, 1ROW, 2MM; HEIGHT: 8mm; MANUFACTURER_NAME: Molex; MANUFACTURER_PART_NUMBER: 560020-0220; MOUSER_PART_NUMBER: 538-560020-0220; MOUSER_PRICE-STOCK: https://www.mouser.co.uk/ProductDetail/Molex/560020-0220?qs=4r2B00tbnb2Q0zW%252Bilmyag%3D%3D
K1-K9 K11-K17 = resistor:R-EU_: RESISTOR, European symbol; MID: CRCW06033K30FKEB
LED1 = led:LED: LED OSRAM: - CHIPLED LG R971, LG N971, LY N971, LG Q971, LY Q971, LO R971, LY R971 LH N974, LH R974 LS Q976, LO Q976, LY Q976 LO Q996 - Hyper CHIPLED LW Q18S LB Q993, LB Q99A, LB R99A - SideLED LS A670, LO A670, LY A670, LG A670, LP A670 LB A673, LV A673, LT A673, LW A673 LH A674 LY A675 LS A676, LA A676, LO A676, LY A676, LW A676 LS A679, LY A679, LG A679 - Hyper Micro SIDELED® LS Y876, LA Y876, LO Y876, LY Y876 LT Y87S - SmartLED LW L88C, LW L88S LB L89C, LB L89S, LG L890 LS L89K, LO L89K, LY L89K LS L896, LA L896, LO L896, LY L896 - TOPLED LS T670, LO T670, LY T670, LG T670, LP T670 LSG T670, LSP T670, LSY T670, LOP T670, LYG T670 LG T671, LOG T671, LSG T671 LB T673, LV T673, LT T673, LW T673 LH T674 LS T676, LA T676, LO T676, LY T676, LB T676, LH T676, LSB T676, LW T676 LB T67C, LV T67C, LT T67C, LS T67K, LO T67K, LY T67K, LW E67C LS E67B, LA E67B, LO E67B, LY E67B, LB E67C, LV E67C, LT E67C LW T67C LS T679, LY T679, LG T679 LS T770, LO T770, LY T770, LG T770, LP T770 LB T773, LV T773, LT T773, LW T773 LH T774 LS E675, LA E675, LY E675, LS T675 LS T776, LA T776, LO T776, LY T776, LB T776 LHGB T686 LT T68C, LB T68C - Hyper Mini TOPLED® LB M676 - Mini TOPLED Santana® LG M470 LS M47K, LO M47K, LY M47K Source: http://www.osram.convergy.de LUXEON: - LUMILED® LXK2-PW12-R00, LXK2-PW12-S00, LXK2-PW14-U00, LXK2-PW14-V00 LXK2-PM12-R00, LXK2-PM12-S00, LXK2-PM14-U00 LXK2-PE12-Q00, LXK2-PE12-R00, LXK2-PE12-S00, LXK2-PE14-T00, LXK2-PE14-U00 LXK2-PB12-K00, LXK2-PB12-L00, LXK2-PB12-M00, LXK2-PB14-N00, LXK2-PB14-P00, LXK2-PB14-Q00 LXK2-PR12-L00, LXK2-PR12-M00, LXK2-PR14-Q00, LXK2-PR14-R00 LXK2-PD12-Q00, LXK2-PD12-R00, LXK2-PD12-S00 LXK2-PH12-R00, LXK2-PH12-S00 LXK2-PL12-P00, LXK2-PL12-Q00, LXK2-PL12-R00 Source: www.luxeon.com KINGBRIGHT: KA-3528ASYC Source: www.kingbright.com
M1-M9 M11-M16 = zetex:PMOSSOT23: MOS FET; MID: BSS308PEH6327XT; OC_FARNELL: unknown; OC_NEWARK: unknown
POWER = con-lstb:MA03-1: PIN HEADER; OC_FARNELL: unknown; OC_NEWARK: unknown
R1 R157 R159-R162 = IIT_BOMBAY_Racing:R-EU_: RESISTOR, European symbol
R3 = rcl:R-EU_: RESISTOR, European symbol; SPICEPREFIX: R
RM1-RM4 = resistor:R-EU_: RESISTOR, European symbol; MID: CRCW0603120RFKEAHP
RN2 RN3 = resistor-net:RN04: RESISTOR NETWORK; MID: 4605X-101-103LF; OC_FARNELL: unknown; OC_NEWARK: unknown
TP1 TP6-TP8 = testpad:TP: Test pad
U$1 = HM2100NL:HM2100NL
U$2 = DXT5551P5:DXT5551P5
U$3 = 6813:LTC6813
U$8 U$9 = IIT_BOMBAY_Racing2:VERTICALBMS8
U$10 U$11 = IIT_BOMBAY_Racing2:VERTICALBMS10
U$13-U$21 U$23-U$27 U$29 U$30 = IIT_BOMBAY_Racing:PTC-FUSE; MID: 0466.200NRHF
X1-X4 = IIT_BOMBAY_Racing:HEADER_POS8_?: Molex - Micro-Fit 3.0 Series connector, 3.00mm (0.118") pitch header, 8 positions.

## Board
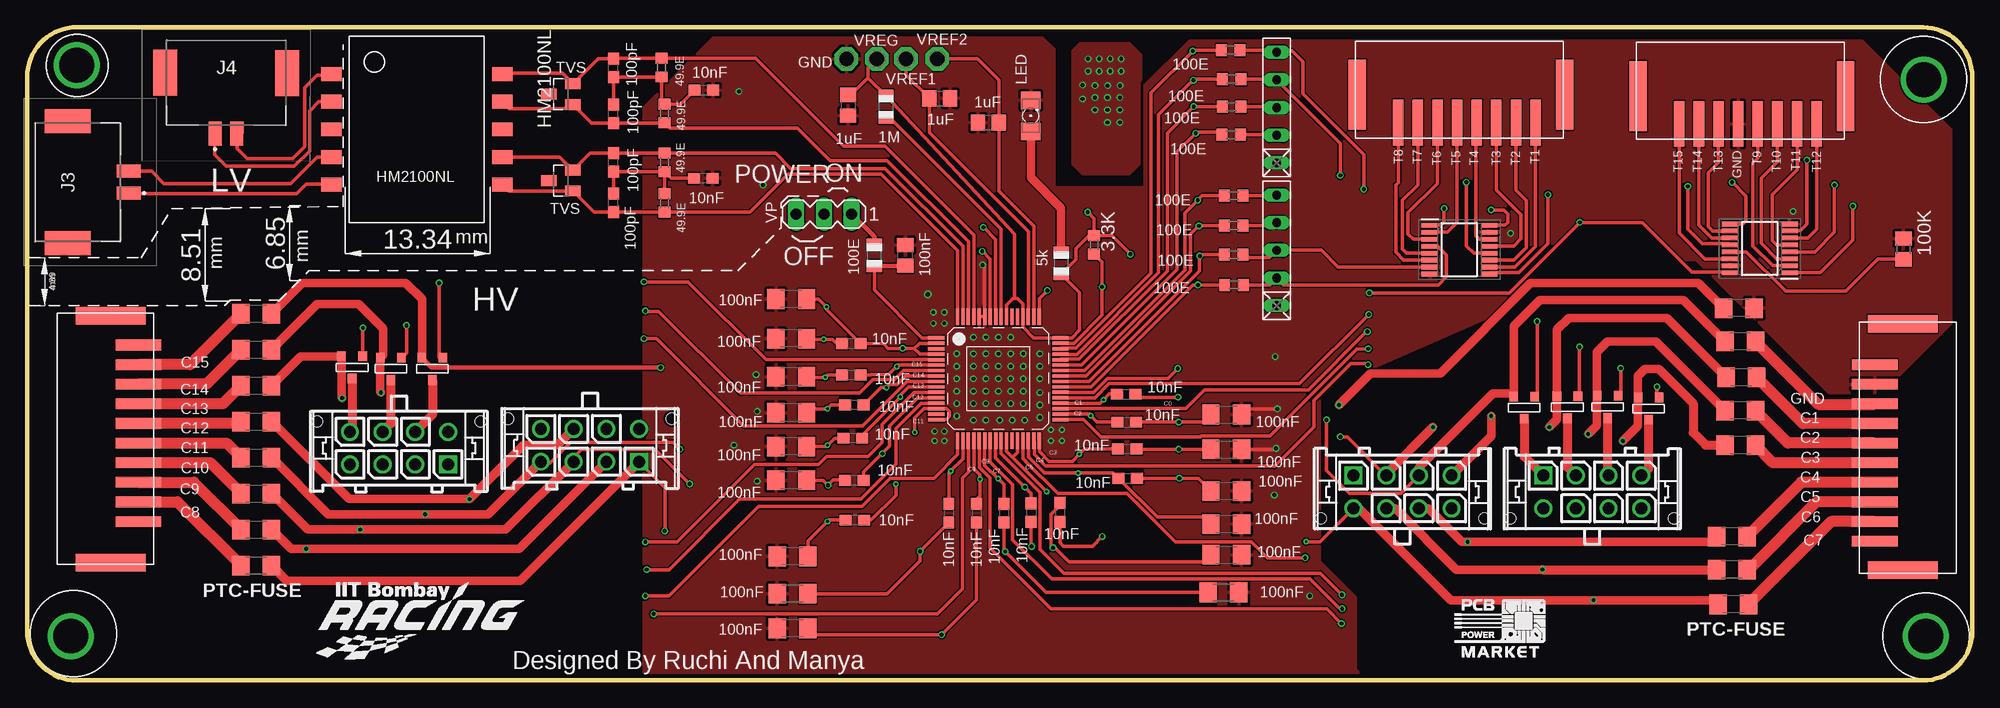
[diagram p7: board, top side]
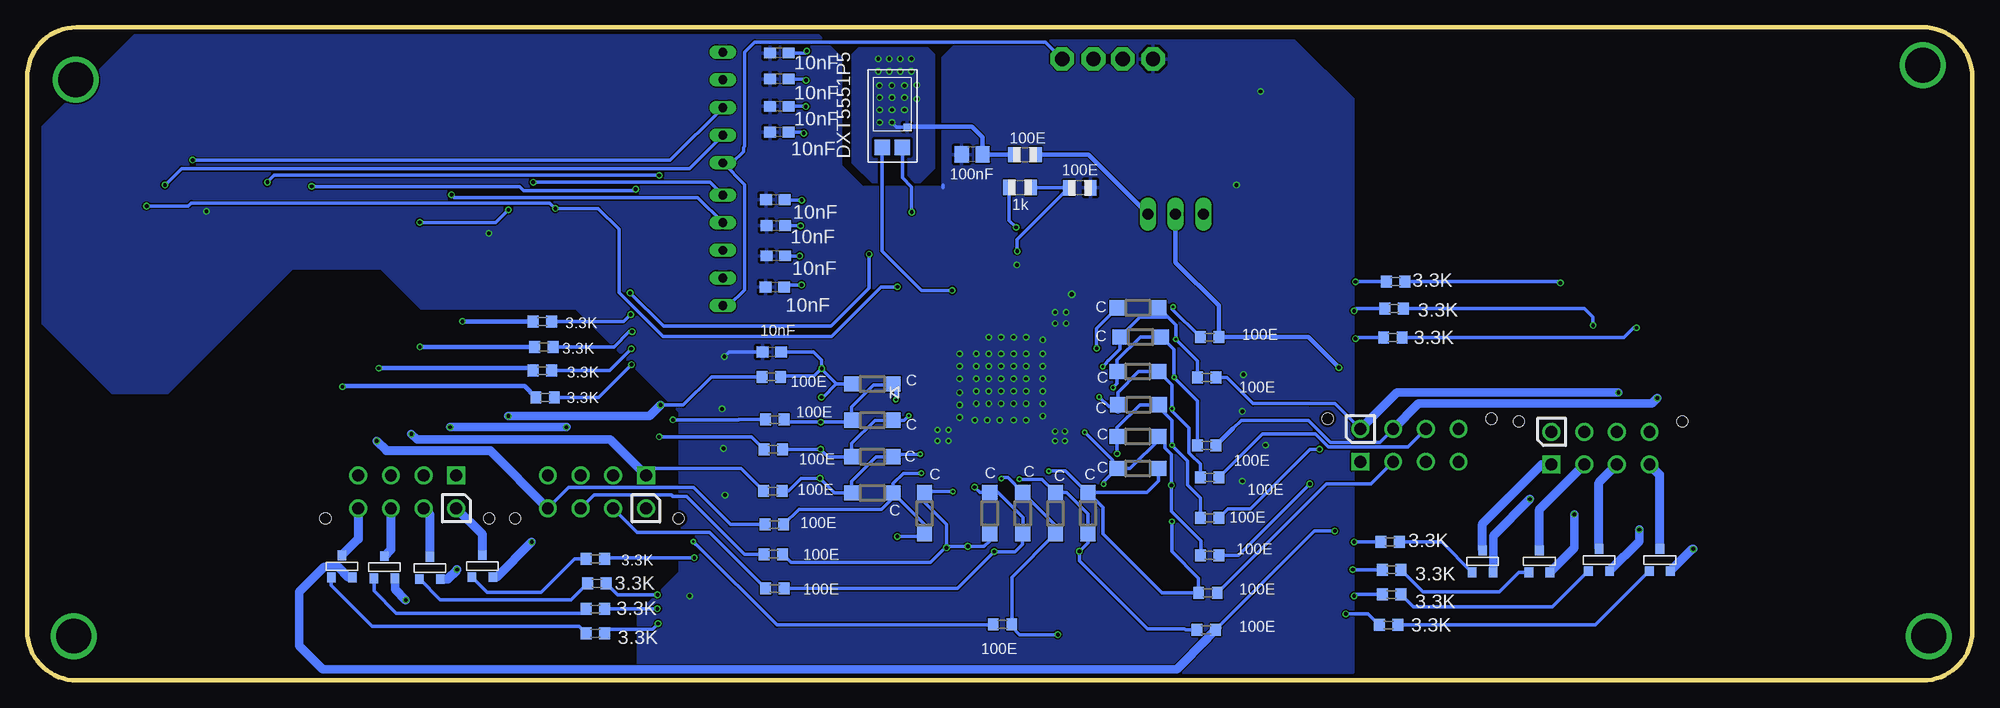
[diagram p8: board, bottom side, seen from below]

Size 178.43 x 59.94 mm. Coordinates in mm from the lower left corner, seen from the top.
Outline: 173.91,0 4.52,0 arc-90 0,4.52 0,55.42 arc-90 4.52,59.94 173.92,59.94 arc-90 178.43,55.37 178.43,4.52 arc-90 173.91,0
Copper layers (1*16): Top 0.035mm / dielectric 1.5mm / Bottom 0.035mm
Design rules "PCB_Power": minimum track width 5mil, minimum drill 10mil, track to track 5mil, track to pad 5mil, pad to pad 5mil, via to via 5mil, smd to smd 5mil, copper to edge 10mil, drill to drill 6mil, minimum pad ring 5mil, minimum via ring 5mil, stop-mask expansion 3mil, vias tented up to drill 0mil, thermal gap 10mil

### Footprints (pad centres in the part's own frame; a part is rotated, then mirrored left to right if it is on the bottom)
C0805 = smd 1.3 x 1.5: 1 -0.95,0; 2 0.95,0
C0603 = smd 1.1 x 1: 1 -0.85,0; 2 0.85,0
SOD123 = smd 1.4 x 1.4: A 1.9,0; C -1.9,0
SOP64P600X175-16N = smd 1.52 x 0.44: 1 -2.715,2.24; 2 -2.715,1.6; 3 -2.715,0.96; 4 -2.715,0.32; 5 -2.715,-0.32; 6 -2.715,-0.96; 7 -2.715,-1.6; 8 -2.715,-2.24; 9 2.715,-2.24; 10 2.715,-1.6; 11 2.715,-0.96; 12 2.715,-0.32; 13 2.715,0.32; 14 2.715,0.96; 15 2.715,1.6; 16 2.715,2.24
R0603 = smd 1 x 1.1: 1 -0.85,0; 2 0.85,0
C1206 = smd 1.6 x 1.8: 1 -1.4,0; 2 1.4,0
SOT23 = smd 1 x 1.4: 1 -0.95,-1.1; 2 0.95,-1.1; 3 0,1.1
5600200220 = smd 1.2 x 2.2: 1 1,3.53; 2 -1,3.53 | smd 2.2 x 4.2: 3 -5.6,-2.05; 4 5.6,-2.05
1206 = smd 1.6 x 1.803: A -1.422,0; C 1.422,0
SOT-23 = smd 0.787 x 0.889: 1 0.025,-1.016; 2 -0.94,1.016; 3 0.991,1.016
MA03-1 = drill 1.016 long: 1 -2.54,0; 2 0,0; 3 2.54,0
R0805 = smd 1.1 x 1.4: 1 -1,0; 2 1,0
R0805' = smd 1.3 x 1.5: 1 -0.95,0; 2 0.95,0
RN-5 = drill 0.813 long: 1 -5.08,0; 2 -2.54,0; 3 0,0; 4 2.54,0; 5 5.08,0
P1-13 = drill 1.321 pad 2.159 octagon: TP 0,0
HM2100NL = smd 1.27 x 1.89: 1 -5.08,-7.84; 2 -2.54,-7.84; 3 0,-7.84; 4 2.54,-7.84; 5 5.08,-7.84; 6 5.08,7.84; 7 2.54,7.84; 8 0,7.84; 9 -2.54,7.84; 10 -5.08,7.84
DXT5551P5 = smd 1.4 x 1.39: B -0.9,-1.534; E 0.94,-1.534 | smd 0.635 x 0.635: C 1.384,0.33
LTC6813 = smd 1.5 x 0.3: C0 5.7,-1.25; C1 5.7,-2.25; C2 5.7,-3.25; C11 -5.7,-3.75; C12 -5.7,-2.75; C13 -5.7,-1.75; C14 -5.7,-0.75; C15 -5.7,0.25; C16 -5.7,1.25; C17 -5.7,2.25; C18 -5.7,3.25; GPIO1 5.7,-0.75; GPIO2 5.7,-0.25; GPIO3 5.7,0.25; GPIO4 5.7,0.75; GPIO5 5.7,1.25; GPIO6 5.7,1.75; GPIO7 5.7,2.25; GPIO8 5.7,2.75; GPIO9 5.7,3.25; S1 5.7,-1.75; S2 5.7,-2.75; S3 5.7,-3.75; S12 -5.7,-3.25; S13 -5.7,-2.25; S14 -5.7,-1.25; S15 -5.7,-0.25; S16 -5.7,0.75; S17 -5.7,1.75; S18 -5.7,2.75; V+ -5.7,3.75; VREG 5.7,3.75 | smd 0.3 x 1.5: C3 3.75,-5.7; C4 2.75,-5.7; C5 1.75,-5.7; C6 0.75,-5.7; C7 -0.25,-5.7; C8 -1.25,-5.7; C9 -2.25,-5.7; C10 -3.25,-5.7; CSB(IMA) -2.25,5.7; DRIVE 3.75,5.7; DTEN 2.25,5.7; IBIAS -0.25,5.7; ICMP -0.75,5.7; IMB -3.25,5.7; IPB -3.75,5.7; ISOMB 0.75,5.7; S4 3.25,-5.7; S5 2.25,-5.7; S6 1.25,-5.7; S7 0.25,-5.7; S8 -0.75,-5.7; S9 -1.75,-5.7; S10 -2.75,-5.7; S11 -3.75,-5.7; SCK(IPA) -2.75,5.7; SDI(NC) 1.75,5.7; SDO(NC) 1.25,5.7; V- -1.75,5.7; V-- -1.25,5.7; VREF1 2.75,5.7; VREF2 3.25,5.7; WDT 0.25,5.7
VERTICALBMS8 = smd 0.97 x 4.2: P$1 -6.246,23; P$2 -4.446,23; P$3 -2.646,23; P$4 -0.846,23; P$5 0.954,23; P$6 2.754,23; P$7 4.554,23; P$8 6.354,23 | smd 1.6 x 6.4: P$9 -10,25.558; P$10 9.02,25.558
VERTICALBMS10 = smd 0.97 x 4.2: P$1 -8.786,3.95; P$2 -6.986,3.95; P$3 -5.186,3.95; P$4 -3.386,3.95; P$5 -1.586,3.95; P$6 0.214,3.95; P$7 2.014,3.95; P$8 3.814,3.95; P$9 5.614,3.95; P$10 7.414,3.95 | smd 1.6 x 6.4: P$11 -12.54,6.508; P$12 10.08,6.508
1206' = smd 1.6 x 1.8: 1 -1.4,0; 2 1.4,0
44914-0801 = drill 1.09 square: P$1 4.5,0 | drill 1.09: P$2 1.5,0; P$3 -1.5,0; P$4 -4.5,0; P$5 4.5,3; P$6 1.5,3; P$7 -1.5,3; P$8 -4.5,3 | hole 1.02: 7.5,3.94; -7.5,3.94

### Placement (x,y rotation side)
C1  75.3,52.78 270 top
C2  53.78,43.84 90 top
C3  53.78,47.55 90 top
C4  62.01,46.08 180 top
C5  53.78,51.99 90 top
C6  53.78,56.21 90 top
C8  62.06,54.15 180 top
C173  91.75,48.26 180 bottom
C175  83.7,53.42 0 top
C176  80.55,39.01 90 top
C177  88.17,51.18 180 top
D1  100.9,27.2 180 bottom
D2  100.9,23.88 180 bottom
D3  100.9,20.52 180 bottom
D4  100.9,17.2 180 bottom
D5  96.12,15.34 270 bottom
D7  90.13,15.34 270 bottom
D8  87.11,15.34 270 bottom
D9  84.11,15.34 270 bottom
D10  81.11,15.34 270 bottom
D11  76.54,19.46 0 bottom
D12  76.54,22.38 0 bottom
D13  76.49,25.3 0 bottom
D14  76.54,28.35 0 bottom
D15  76.29,31.52 0 bottom
D16  76.54,34.19 0 bottom
DEMUX1  158.94,39.65 180 top
DEMUX2  131.38,39.52 0 top
E0  110.17,27.86 0 bottom
E1  109.84,23.93 0 bottom
E2  109.99,21.21 0 bottom
E3  110.02,17.37 0 bottom
E4  109.89,14.3 0 bottom
E5  109.99,11.58 0 bottom
E6  109.84,8.43 0 bottom
E7  88.96,5.16 180 bottom
E8  70.27,4.65 0 bottom
E9  70.11,8.03 0 bottom
E13  69.96,31.5 0 bottom
E14  70.22,27.79 0 bottom
E15  69.96,18.62 180 bottom
E16  69.96,14.91 180 bottom
E17  69.96,11.48 180 bottom
E18  110.68,44.48 180 top
E19  110.68,41.73 180 top
E20  110.68,39.07 180 top
E21  110.7,36.3 180 top
E22  110.45,50.06 180 top
E23  110.5,52.65 180 top
E24  110.5,55.17 180 top
E25  110.4,57.84 180 top
E26  70.22,21.56 180 bottom
F1  109.99,24.41 0 top
F2  109.99,21.21 0 top
F3  109.99,17.37 0 top
F4  109.99,14.35 0 top
F5  109.99,11.53 0 top
F6  109.74,8.08 0 top
F7  70.19,4.78 180 top
F8  70.19,7.95 180 top
F9  70.19,11.38 180 top
F13  70.09,35 180 top
F14  70.09,31.37 180 top
F15  70.09,24.56 180 top
F16  70.09,21.46 180 top
F17  70.09,18.36 180 top
F18  70.09,27.86 180 top
IM1  48.96,53.8 90 top
IM2  48.96,45.87 90 top
J3  5.78,45.72 270 top
J4  18.25,53.7 179.8 top
K1  131.18,32.94 180 bottom
K2  131.05,30.61 180 bottom
K3  131.18,28.42 180 bottom
K4  130.92,25.96 180 bottom
K5  126.3,11.15 180 bottom
K6  126.17,8.92 180 bottom
K7  126.3,6.55 180 bottom
K8  126.3,4.32 180 bottom
K9  53.53,5.08 0 bottom
K11  52.89,36.59 0 bottom
K12  53.02,34.12 0 bottom
K13  53.4,12.7 0 bottom
K14  53.27,10.16 0 bottom
K15  53.27,7.87 0 bottom
K16  53.15,31.46 0 bottom
K17  97.88,39.98 90 top
LED1  92.06,51.82 90 top
M1  137.3,25.02 0 top
M2  141.26,25.07 0 top
M3  144.94,25.1 0 top
M4  148.7,24.94 0 top
M5  136.64,10.49 180 bottom
M6  141.46,10.31 180 bottom
M7  145.63,10.39 180 bottom
M8  149.54,10.46 180 bottom
M9  28.64,11.05 180 bottom
M11  37.15,28.59 0 top
M12  33.34,28.59 0 top
M13  44.89,10.92 180 bottom
M14  39.69,10.92 180 bottom
M15  34.22,11.05 180 bottom
M16  29.78,28.72 0 top
POWER  73.09,42.8 180 top
R1  94.85,38.28 270 top
R3  100K  [R0805']  172.12,39.6 90 top
R157  86.9,48.26 0 bottom
R159  87.36,45.24 180 bottom
R160  81.87,45.21 180 bottom
R161  77.71,39.01 90 top
R162  78.78,52.65 90 top
RM1  58.46,47.55 270 top
RM2  58.46,43.84 270 top
RM3  58.46,52.02 270 top
RM4  58.2,56.24 270 top
RN2  114.62,39.47 90 top
RN3  114.62,52.58 90 top
T0  110.12,30.15 180 bottom
T1  100.82,26.26 0 top
T2  100.87,23.7 0 top
T3  100.9,21.23 0 top
T4  100.98,18.54 0 top
T5  94.73,15.42 270 top
T6  92.09,15.39 270 top
T7  89.6,15.37 270 top
T8  87.08,15.37 270 top
T9  84.54,15.34 270 top
T13  75.6,30.91 180 top
T14  75.6,28.02 180 top
T15  75.73,22.23 180 top
T16  75.85,18.34 180 top
T17  75.93,14.71 180 top
T18  109.79,44.12 180 bottom
T19  109.76,41.73 180 bottom
T20  109.74,38.96 180 bottom
T21  109.84,36.09 180 bottom
T22  109.46,50.32 180 bottom
T23  109.43,52.68 180 bottom
T24  109.43,55.19 180 bottom
T25  109.43,57.58 180 bottom
T26  75.85,25.27 180 top
TP1  83.5,57.05 0 top
TP6  77.95,57.04 0 top
TP7  80.62,57.04 0 top
TP8  75.16,57.02 0 top
U$1  35.74,50.57 270 top
U$2  99.1,50.44 0 bottom
U$3  89.09,27.69 0 top
U$5  [RACING_LOGO_290MIL]  26.17,1.65 0 top
U$6  [330X210]  130.87,1.45 0 top
U$8  132.01,28.19 0 top
U$9  157.8,28.07 0 top
U$10  165.54,20.19 270 top
U$11  14.16,23.37 90 top
U$13  PTC-FUSE  [1206']  21.02,33.66 0 top
U$14  PTC-FUSE  [1206']  21.02,30.35 0 top
U$15  PTC-FUSE  [1206']  21.02,27.05 0 top
U$16  PTC-FUSE  [1206']  21.02,23.75 0 top
U$17  PTC-FUSE  [1206']  21.02,20.45 0 top
U$18  PTC-FUSE  [1206']  21.02,13.84 0 top
U$19  PTC-FUSE  [1206']  21.02,10.54 0 top
U$20  PTC-FUSE  [1206']  156.5,6.98 180 top
U$21  PTC-FUSE  [1206']  156.37,10.16 180 top
U$23  PTC-FUSE  [1206']  156.37,13.21 180 top
U$24  PTC-FUSE  [1206']  157.13,21.59 180 top
U$25  PTC-FUSE  [1206']  157.13,24.77 180 top
U$26  PTC-FUSE  [1206']  157.26,27.81 180 top
U$27  PTC-FUSE  [1206']  157.13,31.12 180 top
U$29  PTC-FUSE  [1206']  21.02,17.14 0 top
U$30  PTC-FUSE  [1206']  157.01,34.16 180 top
X1  34.1,19.81 0 top
X2  143.57,18.8 180 top
X3  51.62,20.07 0 top
X4  126.17,18.8 180 top

### Tracks (layer width: path | path; a pad name or v marks a point on that pad's centre or on a via)
C  (via drill 0.35)
  Bottom 0.305: v99.1,51.21 98.66,50.77 U$2.C
  Bottom 0.406: R157.1 C173.1 90.81,49.85 91.75,50.8 97.69,50.8 U$2.C
  other vias: 99.11,54.58 100.25,54.58 97.32,55.91 97.95,54.58 97.95,53.49 99.1,53.49 100.24,53.49 99.1,52.35 100.24,52.35 97.95,52.35 100.24,51.21 100.37,55.91 99.35,55.91 98.33,55.91 100.37,57.05 99.35,57.05 98.33,57.05 97.32,57.05 96.81,53.37 96.81,54.64
  pour Top (isolate 0.254, rank 2): 96.56,58.45 101.13,58.45 102.14,57.43 102.14,47.52 101.13,46.51 96.81,46.51 95.92,47.4 95.92,57.81
  pour Bottom (isolate 0.254, rank 3): 96.68,58.83 101.25,58.83 102.65,57.43 102.65,47.52 100.75,45.62 96.68,45.62 95.29,47.02 95.29,57.43
C0  (via drill 0.35)
  Top 0.305: U$3.C0 97.81,26.44 99.1,27.72 104.64,27.72 v105.55,28.63 | v105.57,25.98 101.95,25.98
  Top 0.406: 101.95,25.98 T1.2
  Bottom 0.305: v105.55,28.63 105.55,29.39 106.31,30.15 T0.1 | v105.55,28.63 106.23,27.94 109.24,27.94 E0.2 | v105.57,25.98 105.45,25.98 104.23,27.2 104.18,27.2 | v105.55,28.63 105.55,28.57 104.18,27.2 | D1.A 104.18,27.2
C1  (via drill 0.25, 0.35)
  Top 0.305: U$3.C1 98.42,25.44 v98.74,25.76 99.25,26.26 T1.1 | F1.1 107.88,23.7 v105.65,23.7 T2.2
  Bottom 0.305: D1.C 98.89,27.1 | v98.74,25.76 98.74,27.05 98.79,27.1 98.89,27.1 | 98.89,27.1 100.8,27.1 102.8,25.09 D2.A 102.98,23.7 v105.65,23.7 108.76,23.7 E1.2
C2  (via drill 0.25, 0.35)
  Top 0.305: U$3.C2 97.43,24.44 97.57,24.29 v97.57,24.28 98.16,23.7 T2.1 | F2.1 v105.65,21.21 101.77,21.21 T3.2
  Bottom 0.305: v97.57,24.28 97.98,23.88 D2.C 100.65,23.88 102.8,21.73 D3.A 104.96,20.52 v105.65,21.21 E2.2
C3  (via drill 0.25, 0.35)
  Top 0.305: T3.1 96.99,21.23 v96.5,20.75 95.87,20.12 93.72,20.12 92.84,21 U$3.C3 | F3.1 107.42,18.54 v105.7,18.54 T4.2
  Bottom 0.305: v96.5,20.75 98.67,20.75 98.95,20.47 D3.C 100.55,20.52 102.8,18.27 D4.A 104.35,17.2 v105.7,18.54 107.43,18.54 F3.1 E3.2
C4  (via drill 0.25, 0.35)
  Top 0.305: U$3.C4 91.84,20.5 93.32,19.02 v96.4,19.02 96.43,19.05 99.62,19.05 T4.1 103.68,14.99 107.96,14.99 F4.1 | T5.2 94.73,12.65 95.06,12.32 97.72,12.32 v98.61,13.21
  Bottom 0.305: v96.4,19.02 96.43,19 98.05,19 99,18.05 D4.C | D4.C 99,16.76 100.07,15.7 107.64,15.7 E4.2 | D4.C 96.12,14.32 D5.A 96.12,13.34 96.25,13.21 v98.61,13.21
C5  (via drill 0.25, 0.35)
  Top 0.305: F5.1 107.96,10.9 95.56,10.9 94.29,12.17 v94.1,12.17 93.92,12.35 93.92,15.24 94.73,16.05 T5.1 | T6.2 92.09,12.35 v92.14,12.3 | v93.51,17.32 90.37,20.46 | 90.37,20.46 89.84,20.99 U$3.C6 | U$3.C5 90.84,20.93 90.37,20.46
  Bottom 0.305: E5.2 108.38,10.82 95.58,10.82 94.23,12.17 v94.1,12.17 | D7.A 90.13,12.81 90.64,12.3 v92.14,12.3 93.97,12.3 v94.1,12.17 | v94.1,12.17 94.1,14.33 96.12,16.35 D5.C 96.02,17.34 93.53,17.34 v93.51,17.32
C6  (via drill 0.35)
  Top 0.305: T6.1 92.09,17.17 v91.53,17.73 88.84,20.42 U$3.C7 | T7.2 89.6,11.94 v89.72,11.81 93.46,8.08 F6.1
  Bottom 0.305: v91.53,17.73 91.04,17.24 D7.C 89.37,17.24 87.08,14.96 87.08,13.46 D8.A 87.11,12.5 87.8,11.81 v89.72,11.81 93.1,8.43 E6.2
C7  (via drill 0.25, 0.35)
  Top 0.305: T7.1 89.6,17.98 v89.06,18.52 87.84,19.74 U$3.C8 | F7.1 72.17,4.19 v83.88,4.19 87.08,7.39 T8.2
  Bottom 0.305: v89.06,18.52 89.06,18.61 88.48,18.61 D8.C 84.11,14.24 D9.A 84.14,13.44 88.11,9.47 E7.1 88.11,4.9 87.4,4.19 v83.88,4.19
C8  (via drill 0.25, 0.35)
  Top 0.305: F8.1 78.89,7.95 81.91,10.97 v81.91,11.84 81.91,11.86 T9.2 | U$3.C9 86.84,19.42 87.41,18.85 v87.41,18.47 87.41,16.94 87.03,16.56 87.03,16.27 T8.1
  Bottom 0.305: v87.41,18.47 85.33,18.47 D9.C 83.09,17.24 81.11,15.26 D10.A 81.11,12.64 v81.91,11.84 81.91,10.95 75.68,4.73 72.27,4.73 72.18,4.65 E8.1
C9  (via drill 0.25)
  Top 0.305: T17.2 73.54,14.71 v73.42,14.58 71.64,12.8 71.64,11.43 F9.1 | U$3.C10 85.84,20.32 v84.72,19.2 84.54,19.02 T9.1
  Bottom 0.305: v73.42,14.58 73.42,11.83 70.96,9.37 E9.1 74.35,8.03 79.77,13.44 79.77,15.89 D10.C | D10.C 81.23,17.24 83.2,19.2 v84.72,19.2 | D10.C 75.71,17.24 74.64,18.31 D11.A
C10  (via drill 0.25, 0.35)
  Top 0.305: F17.1 73.01,18.36 v73.47,17.91 73.47,17.96 73.9,18.39 74.95,18.39 T16.2 | v79.69,18.01 79.69,16.99 77.4,14.71 T17.1 | v81.42,22.76 81.42,24.08 82.27,24.94 U$3.C12 84.34,24.94 84.59,24.68 84.59,24.21 84.32,23.94 U$3.C11
  Bottom 0.305: v81.42,22.76 78.88,20.22 78.88,19.51 78.82,19.46 D11.C | D11.C 77.25,19.46 74.49,22.22 D12.A 74.04,21.78 74.04,21.31 73.47,20.74 v73.47,17.91 73.47,15.53 70.75,12.81 70.75,11.54 E17.2 | D11.C 79.69,18.21 v79.69,18.01
C11  (via drill 0.25, 0.35)
  Top 0.305: F16.1 73.29,21.46 v73.41,21.57 74.06,22.23 T15.2 | U$3.C13 81.67,25.94 79.11,23.37 79.11,21.51 78.42,20.83 v78.45,20.8 78.37,20.8 76.7,19.14 T16.1
  Bottom 0.305: v73.42,21.57 v73.41,21.57 | v78.45,20.8 v78.44,20.81 D12.C 78.44,23.22 76.36,25.3 D13.A 74.59,25.04 73.42,23.87 v73.42,21.57 | v73.42,21.57 71.99,20.14 71.99,17.95 70.81,16.76 E16.2
C12  (via drill 0.25)
  Top 0.305: T26.2 73.75,25.27 v73.41,24.93 71.86,24.93 F15.1 | U$3.C14 81.47,26.94 81.46,26.92 80.84,26.92 80.1,26.19 v80.1,26.01 76.58,22.49 T15.1
  Bottom 0.305: 78.39,24.87 78.14,25.12 78.21,25.12 D13.C | E15.2 70.81,19.87 71.66,20.71 71.69,20.71 71.87,20.89 71.87,22.24 71.84,22.27 71.84,23.16 73.41,24.73 v73.41,24.93 73.41,27.11 D14.A 76.48,28.35 78.39,26.44 D13.C | v80.1,26.01 79.21,25.12 78.57,25.12 D13.C
  Bottom 0.762: D13.C 78.39,24.87
C13  (via drill 0.25)
  Top 0.305: F18.1 71.54,27.81 v73.22,27.81 73.42,28.02 T14.2 | T26.1 78.31,26.87 v78.83,26.87 79.11,27.15 79.77,27.15 80.55,27.94 U$3.C15
  Bottom 0.305: E26.2 71.07,25.66 v73.22,27.81 73.22,30.35 D15.A 76.31,31.52 78.44,29.39 D14.C 78.44,27.26 v78.83,26.87
C14  (via drill 0.25)
  Top 0.305: T13.2 74.24,30.91 73.86,31.29 73.06,31.29 v73.06,31.3 71.56,31.3 F14.1 | T14.1 76.48,28.04 77.37,28.04 77.39,28.07 79.03,28.07 v79.77,28.8 79.9,28.94 U$3.C16
  Bottom 0.305: D16.A 73.79,33.34 | 73.79,33.34 73.06,32.61 v73.06,31.3 71.07,29.3 E14.1 | 73.79,33.34 76.37,33.34 D15.C 78.19,30.4 79.23,29.35 79.27,29.35 79.45,29.17 79.45,29.12 v79.77,28.8
C15  (via drill 0.25, 0.35)
  Top 0.305: F13.1 72.6,35 v73.32,34.28 73.32,34.04 T13.1 78.55,30.91 78.98,30.48 v80.33,30.48 80.35,30.45 81.37,30.45 | U$3.C17 81.89,29.94 81.37,30.45 | 81.37,30.45 81.85,30.94 U$3.C18
  Bottom 0.305: v73.32,34.28 73.42,34.19 73.42,34.1 E13.1 | D16.C 80.33,32.3 v80.33,30.48
C_01
  Top 1.016: U$27.1 164.32,25.33 169.44,25.33 U$10.P$3
C_02
  Top 1.016: U$10.P$4 162.9,23.58 U$26.1
C_03
  Top 1.016: U$10.P$5 161.52,21.78 U$25.1
C_04
  Top 1.016: U$10.P$6 160.15,19.98 U$24.1
C_05
  Top 1.016: U$10.P$7 162.74,18.18 U$23.1
C_06
  Top 1.016: U$10.P$8 164.14,16.38 157.92,10.16 U$21.1
C_07
  Top 1.016: U$10.P$9 165.49,14.58 U$20.1
C_08
  Top 1.016: U$11.P$2 13.78,16.38 U$19.1
C_09
  Top 1.016: U$11.P$3 15.28,18.18 U$18.1
C_10
  Top 1.016: U$11.P$4 16.78,19.98 U$29.1
C_11
  Top 1.016: U$11.P$5 18.28,21.78 U$17.1
C_12
  Top 1.016: U$16.1 19.45,23.58 U$11.P$6
C_13
  Top 1.016: U$15.1 17.95,25.38 U$11.P$7
C_14
  Top 1.016: U$14.1 16.45,27.18 U$11.P$8
C_15
  Top 1.016: U$13.1 14.94,28.98 U$11.P$9
CELL_0_IN
  Top 0.813: X2.P$1 137.32,20.54 M1.1
CELL_0_OUT  (via drill 0.35)
  Top 0.762: U$30.2 153.32,36.45 137.9,36.45 129.62,28.17 123.23,28.17 v120.33,25.27 | v134.3,24.26 134.3,22.42 X4.P$4
  Bottom 0.305: E0.1 115.66,27.86 118.25,25.27 v120.33,25.27
  Bottom 0.762: v120.33,25.27 121.35,24.26 v134.3,24.26
CELL_1_IN
  Top 0.813: M2.1 141.28,19.58 X2.P$2
CELL_1_OUT  (via drill 0.35)
  Top 0.305: X4.P$3 126.02,17.15 124.52,17.15 124.52,17.14 121.29,17.14 119.19,19.25 v119.19,23.91
  Top 0.762: U$27.2 151.93,34.92 138.75,34.92 136.36,32.54 M1.2 136.05,26.35 134.46,26.35 127.67,19.56 X4.P$3
  Bottom 0.305: E1.1 113.17,23.93 113.19,23.91 v119.19,23.91
CELL_2_IN
  Top 0.813: M3.1 144.97,18.9 X2.P$3
CELL_2_OUT  (via drill 0.35)
  Top 0.305: 124.66,18.78 121.09,22.35 v120.46,22.35
  Top 0.762: U$26.2 150.4,33.27 141.41,33.27 140.32,32.18 M2.2 140.32,23.93 v139.63,23.24 | v128.97,23.24 124.67,18.95 X4.P$2 124.66,18.78
  Bottom 0.305: v120.46,22.35 111.98,22.35 E2.1
  Bottom 0.762: v139.63,23.24 v128.97,23.24
CELL_3_IN
  Top 0.813: M4.1 148.73,19.45 X2.P$4
CELL_3_OUT  (via drill 0.35)
  Top 0.762: U$25.2 149.38,31.12 144.97,31.12 144,30.15 M3.2 144,23.42 v143.19,22.61
  Bottom 0.305: E3.1 110.89,17.37 112.94,19.43 121.04,19.43 X4.P$1
  Bottom 0.762: v143.19,22.61 142.68,22.1 124.97,22.1 X4.P$1
CELL_4_IN
  Bottom 0.813: X2.P$5 136.66,13.39 M5.1
CELL_4_OUT  (via drill 0.35)
  Top 0.762: v146.37,21.97 147.76,23.37 M4.2 147.76,27.94 148.4,28.57 149.67,28.57 152.84,25.4
  Top 0.813: 152.84,25.4 152.84,22.73 153.99,21.59 U$24.2
  Bottom 0.305: E4.1 113.92,14.3 117.32,17.7 128.77,17.7 X4.P$8
  Bottom 0.762: v146.37,21.97 145.48,21.08 | 135.96,21.08 X4.P$8
  Bottom 0.813: 145.48,21.08 135.96,21.08
CELL_5_IN
  Bottom 0.813: M6.1 141.49,15.21 X2.P$6
CELL_5_OUT  (via drill 0.35)
  Top 0.762: U$23.2 154.47,12.7 v132.14,12.7 131.63,12.7 128.54,15.8 X4.P$7
  Bottom 0.305: E5.1 112.62,11.58 117.93,16.89 119.21,16.89 119.34,17.02 126.45,17.02 X4.P$7
  Bottom 0.762: v132.14,12.7 135.37,9.47 M5.2
CELL_6_IN
  Bottom 0.813: M7.1 145.07,11.99 X2.P$7
CELL_6_OUT  (via drill 0.35)
  Top 0.762: v139,10.16 131.12,10.16 125.49,15.8 X4.P$6
  Top 0.813: v139,10.16 U$21.2
  Bottom 0.305: E6.1 115.85,13.59 122.47,13.59 X4.P$6
  Bottom 0.813: M6.2 139.86,9.3 v139,10.16
CELL_7_IN
  Bottom 0.813: X2.P$8 148.07,12.97 M8.1
CELL_7_OUT  (via drill 0.25, 0.35)
  Top 0.305: v117.33,12.72 118.6,12.72 X4.P$5
  Top 0.762: U$20.2 154.72,7.37 v143.7,7.37 130.61,7.37 122.18,15.8 X4.P$5
  Bottom 0.305: E7.2 89.89,5.08 109.66,5.08 117.08,12.5 117.1,12.5 v117.33,12.72
  Bottom 0.762: M7.2 144.69,8.36 v143.7,7.37
CELL_8_IN
  Bottom 0.813: M9.1 28.66,18.88 X1.P$4
CELL_8_OUT  (via drill 0.35)
  Top 0.305: X3.P$1 58.54,17.65 58.54,13.77 v58.48,13.72
  Top 0.762: U$19.2 23.81,9.14 45.2,9.14 X3.P$1
  Bottom 0.305: E8.2 69.26,4.81 60.35,13.72 v58.48,13.72
  Bottom 0.762: M8.2 148.97,9.45 149.93,10.4 151.2,10.4 153.48,8.13 153.48,3.18 151.32,1.02 72.98,1.02 70.11,3.89 70.11,3.96 69.26,4.81
CELL_9_IN
  Bottom 0.813: M15.1 34.25,18.16 X1.P$3
CELL_9_OUT  (via drill 0.35)
  Top 0.762: U$18.2 24.19,12.06 v25.59,12.06 45.12,12.06 X3.P$2
  Bottom 0.305: X3.P$2 53.15,20.07 55.18,18.03 59.26,18.03 E9.2
  Bottom 0.762: M9.2 25.66,12.06 v25.59,12.06
CELL_10_IN
  Bottom 0.813: M14.1 39.71,15.7 X1.P$2
CELL_10_OUT  (via drill 0.35)
  Top 0.305: v60.77,18.03 57.59,21.21 50.86,21.21 50.12,20.47 X3.P$3
  Top 0.762: U$29.2 25.72,13.84 v30.54,13.84 43.9,13.84 X3.P$3
  Bottom 0.305: E17.1 67.32,11.48 v60.77,18.03
  Bottom 0.762: M15.2 30.54,12.78 v30.54,13.84
CELL_11_IN
  Bottom 0.813: M13.1 44.92,14.38 39.49,19.81 X1.P$1
CELL_11_OUT  (via drill 0.35)
  Top 0.305: v59.88,21.21 59.24,21.84 49.84,21.84 47.96,19.97 47.02,19.97
  Top 0.762: U$17.2 27.62,15.24 v36.51,15.24 42.3,15.24 47.02,19.97 X3.P$4
  Bottom 0.305: v59.88,21.21 60.77,21.21 66.23,15.75 68.27,15.75 E16.1
  Bottom 0.762: M14.2 36.51,12.14 v36.51,15.24
CELL_12_IN
  Top 0.305: X1.P$8 29.8,23.02
  Top 0.813: M16.1 29.8,23.02
CELL_12_OUT  (via drill 0.35)
  Top 0.762: U$16.2 29.53,16.64 39.81,16.64 v40.57,16.64 45.53,21.59 48.65,21.59 X3.P$7
  Bottom 0.305: X3.P$7 51.78,21.41 59.04,21.41 60.23,22.61 65.12,22.61 E15.1
  Bottom 0.762: v40.57,16.64 43.95,13.26 M13.2
CELL_13_IN
  Top 0.813: M12.1 33.36,23.57 X1.P$7
CELL_13_OUT  (via drill 0.35)
  Top 0.762: U$15.2 25.1,29.73 M16.2 28.84,25.96 v28.89,25.91
  Bottom 0.305: 67.83,23.11 67.05,23.88 60.89,23.88 58.86,21.84 54.34,21.84 X3.P$6
  Bottom 0.406: E26.1 67.83,23.11
  Bottom 0.762: v28.89,25.91 29.4,25.4 50.79,25.4 X3.P$6
CELL_14_IN
  Top 0.813: M11.1 37.17,24.39 X1.P$6
CELL_14_OUT  (via drill 0.35)
  Top 0.762: U$14.2 26.61,34.54 30.41,34.54 32.65,32.31 32.65,29.86 M12.2 32.4,26.47 v32.45,26.42
  Bottom 0.305: E14.2 68.36,27.79 65.97,25.4 60.77,25.4 58.46,25.4 X3.P$5
  Bottom 0.762: v32.45,26.42 52.77,26.42 X3.P$5
CELL_15_OUT  (via drill 0.35)
  Top 0.406: M11.2 37.11,28.7 v58.1,28.7
  Top 0.762: M11.2 36.2,34.98 34.73,36.45 25.21,36.45 U$13.2
  Bottom 0.406: v58.1,28.7 60.89,31.5 E13.2 69.11,34.38 73.09,38.35 POWER.2
GND  (via drill 0.3, 0.35, 0.4)
  Top 0.305: U$3.V- U$3.V-- 87.84,37.93 v87.64,38.12 | F1.2 111.9,24.92 v114.69,24.92 | v114.56,21.29 114.49,21.21 F2.2
  Bottom 0.305: T0.2 114.06,30.15 v114.49,29.72 | 94.42,45.47 94.42,45.21
  other vias: 82.61,35.43 86.8,29.97 87.95,29.97 89.09,29.97 90.23,29.97 91.37,29.97 90.23,28.83 91.37,28.83 89.09,28.83 87.95,28.83 86.8,28.83 86.8,27.69 87.95,27.69 90.23,27.69 91.37,27.69 91.37,26.54 90.23,26.54 89.09,26.54 87.95,26.54 86.8,26.54 86.8,25.4 87.95,25.4 89.09,25.4 90.23,25.4 91.37,25.4 85.28,25.4 85.28,24.26 85.28,27.69 85.28,26.54 85.28,29.97 85.28,28.83 85.28,31.24 86.8,31.5 87.95,31.5 89.09,31.5 90.23,31.5 92.9,29.97 92.9,28.83 92.9,27.69 92.9,26.42 92.9,25.27 91.5,23.88 92.9,24.13 89.22,23.88 90.36,23.88 86.8,23.88 87.95,23.88 89.09,27.69 84.14,21.97 84.14,22.86 83.25,22.86 83.25,21.97 94.93,22.99 94.93,21.97 93.91,21.97 93.91,22.99 84.14,32.77 83.12,32.77 84.14,33.78 83.12,33.78 114.41,17.02 66.96,24.69 66.96,18.29 64.83,21.59 66.86,28.07 67.5,45.47 117.66,7.75 161.99,43.05 136.08,41.02 65.29,54.05
  pour Top: 56.58,0.76 56.58,52.58 62.93,58.93 93.15,58.93 94.17,57.91 94.17,45.21 102.3,45.21 102.55,44.96 102.55,54.61 106.61,58.67 168.34,58.67 176.46,50.55 176.46,32.77 170.11,26.42 165.29,26.42 153.1,38.61 146.12,38.61 120.17,27.27 118.55,25.65 118.55,10.92 121.85,7.62 121.85,1.02 122.11,0.76
  pour Bottom: 56.83,0.76 56.83,53.34 62.16,58.67 92.9,58.67 94.42,57.15 94.42,45.21 101.79,45.21 103.82,47.24 103.82,57.15 105.85,59.18 168.59,59.18 176.97,50.8 176.97,32.77 170.62,26.42 165.54,26.42 154.11,37.85 145.98,37.85 142.3,34.16 128.08,34.16 118.55,24.64 118.55,9.91 122.36,6.1 122.36,0.76
IM_A
  Top 0.305: U$1.1 27.78,55.52 26.58,55.52 25.46,54.41 25.46,49 24.34,47.88 20.17,47.88 19.26,48.79 19.26,50.14 J4.2
IM_B
  Top 0.305: U$1.4 26.58,48.03 24.14,45.59 12.53,45.59 11.4,46.72 J3.2
IMA
  Top 0.305: U$1.10 43.65,55.71 49.09,55.71 IM1.2 52.37,57.06 C6.2 53.81,57.09 RM4.1 66.8,57.09 74.86,49.02 78.67,49.02 86.84,40.86 U$3.CSB(IMA)
IMB
  Top 0.305: U$3.IMB 85.84,39.85 78.7,46.99 70.04,46.99 68.63,48.4 RM1.1 C3.2 51.63,48.4 IM2.2 48.85,48.03 U$1.7
IP_A
  Top 0.305: U$1.2 26.75,53.11 25.89,52.25 25.89,48.59 24.5,47.19 18.25,47.19 17.21,48.23 17.21,50.14 J4.1
IP_B
  Top 0.305: U$1.5 27.85,45.54 25.59,45.54 24.72,44.67 9.36,44.67 J3.1
IPA
  Top 0.305: U$1.9 44.22,52.47 49.68,52.47 IM1.1 51.76,51.14 C5.1 58.43,51.14 RM3.2 58.96,50.66 70.69,50.66 73.64,47.7 78.89,47.7 86.34,40.25 U$3.SCK(IPA)
IPB
  Top 0.305: U$3.IPB 85.34,39.46 78.32,46.48 69.78,46.48 66.29,42.99 RM2.2 C2.1 51.99,42.99 IM2.1 44.15,44.92 U$1.6
N$3
  Top 0.305: RM1.2 C3.1 C2.2 | RM1.2 RM2.1 | RM1.2 59.08,46.08 C4.2
N$6  (via drill 3.2)
  other vias: 4.53,56.47
N$7
  Top 0.305: C5.2 C6.1 58.18,55.36 RM4.2 58.2,53.12 RM3.1 59.93,52.87 C8.2
N$8
  Top 0.305: U$3.WDT 89.34,41.43 79.12,51.65 R162.1
N$9
  Top 0.305: DEMUX1.13 157.71,39.33 161.33,35.71 166.84,35.71 169.77,38.65 R3.1
N$14  (via drill 0.35)
  Top 0.305: U$3.ICMP 88.34,38.67 v87.61,39.39
  Bottom 0.305: R159.1 86.34,45.21 R160.2 87.61,40.47 v87.61,39.39
N$19  (via drill 0.35)
  Top 0.305: v138.52,32.94 138.52,26.26 M1.3
  Bottom 0.406: v138.52,32.94 K1.2
N$22  (via drill 0.35)
  Top 0.305: M2.3 142.4,26.24 v142.4,30.61
  Bottom 0.406: v142.4,30.61 K2.2
N$23  (via drill 3.2)
  other vias: 4,4.06
N$24  (via drill 3.2)
  other vias: 173.97,55.12
N$25  (via drill 0.35)
  Top 0.305: v146.19,28.65 146.19,26.37 M3.3
  Bottom 0.305: 146.16,28.68 v146.19,28.65
  Bottom 0.406: 146.16,28.68 132.28,28.68 K3.2
N$26  (via drill 3.2)
  other vias: 174.18,4.06
N$31  (via drill 0.35)
  Top 0.305: M4.3 149.51,26.14 v149.51,26.95
  Bottom 0.406: K4.2 132.81,27 149.51,27 v149.51,26.95
N$37
  Bottom 0.305: M5.3 136.26,8.1 131.28,8.1 128.23,11.15 K5.2
N$41
  Bottom 0.305: K6.2 128.55,7.39 140.55,7.39 M6.3
N$43
  Bottom 0.305: K7.2 127.53,6.17 144.59,6.17 146.62,8.2 M7.3
N$48  (via drill 0.35)
  Top 0.305: v30.79,32.37 30.79,29.75 M16.3
  Bottom 0.305: K16.2 31.94,31.46 31.04,32.37 v30.79,32.37
N$50
  Bottom 0.305: K8.2 127.78,4.95 146.77,4.95 150.53,8.71 M8.3
N$51
  Bottom 0.305: M9.3 34.58,5.08 K9.2
N$63  (via drill 0.35)
  Top 0.305: v34.79,32.57 34.79,30.07 M12.3
  Bottom 0.305: K12.2 35.57,34.12 34.79,33.34 v34.79,32.57
N$89
  Bottom 0.305: M15.3 38.52,6.73 51.28,6.73 K15.2
N$91
  Bottom 0.305: M14.3 41.59,9.91 43.37,8.13 50.39,8.13 K14.2
N$93
  Bottom 0.305: M13.3 48.68,12.7 K13.2
N$95  (via drill 0.35)
  Top 0.305: v37.79,36.48 37.79,29.61 M11.3
  Bottom 0.305: K11.2 37.9,36.59 v37.79,36.48
N$227  (via drill 0.35)
  Top 0.305: U$3.DRIVE 92.84,35.04 v93.58,35.79
  Bottom 0.305: U$2.B 100,39.38 96.41,35.79 v93.58,35.79
N$241  (via drill 0.35)
  Top 0.305: v87.72,41.58 88.84,40.46 U$3.IBIAS
  Bottom 0.305: R159.2 88.35,45.23 88.35,42.22 v87.72,41.58
N$246
  Top 0.305: U$3.V+ 82.09,31.44 77.71,35.82 R161.1
  Top 0.406: C176.1 80.5,38.01 R161.1
P_TEMP1
  Top 0.305: DEMUX2.10 134.11,37.94 136.49,37.94 138.37,39.81 U$8.P$8
P_TEMP2
  Top 0.305: DEMUX2.11 134.11,38.58 136.37,38.58 137.52,39.73 137.52,44.03 136.57,44.98 U$8.P$7
P_TEMP3
  Top 0.305: DEMUX2.13 134.11,39.86 136.37,39.86 137.04,40.53 137.04,42.73 134.77,45 U$8.P$6
P_TEMP4
  Top 0.305: U$8.P$5 132.9,51.13 132.9,40.77 133.19,40.48 DEMUX2.14
P_TEMP5
  Top 0.305: DEMUX2.2 128.68,41.14 130.3,41.14 131.17,42 U$8.P$4
P_TEMP6
  Top 0.305: DEMUX2.3 128.65,40.5 127.15,40.5 126.68,40.97 126.68,42.93 129.37,45.61 U$8.P$3
P_TEMP7
  Top 0.305: DEMUX2.5 128.54,39.2 128.52,39.22 126.52,39.22 126.17,39.56 126.17,44.07 127.57,45.47 U$8.P$2
P_TEMP8
  Top 0.305: DEMUX2.6 128.41,38.56 128.4,38.58 126.26,38.58 125.54,39.3 125.54,45.47 125.77,45.7 U$8.P$1
P_TEMP9
  Top 0.305: U$9.P$5 158.75,47.94 158.3,47.5 158.3,39.88 160.13,38.05 DEMUX1.2
P_TEMP10
  Top 0.305: DEMUX1.3 160.51,38.69 159.06,40.13 159.06,46.1 160.55,47.59 U$9.P$6
P_TEMP11
  Top 0.305: DEMUX1.5 160.5,39.97 160.08,40.39 160.08,44.58 162.37,46.86 162.37,51.05 U$9.P$7
P_TEMP12
  Top 0.305: U$9.P$8 164.15,41.41 163.35,40.61 DEMUX1.6
P_TEMP13
  Top 0.305: DEMUX1.14 153.9,38.69 151.55,41.04 U$9.P$1
P_TEMP14
  Top 0.305: DEMUX1.11 154.52,40.61 153.35,41.78 U$9.P$2
P_TEMP15
  Top 0.305: DEMUX1.10 154.65,41.25 154.24,41.66 154.24,46.61 155.15,47.52 U$9.P$3
R
  Top 0.762: LED1.A 92.06,46.14 94.85,43.34 R1.1
S1  (via drill 0.35)
  Top 0.305: U$3.S1 97.95,25.94 99.25,27.23 116.73,27.23 v123.07,33.58
  Bottom 0.305: v123.07,33.58 123.71,32.94 K1.1
S2  (via drill 0.35)
  Top 0.305: U$3.S2 94.8,24.94 106.28,24.94 108.01,26.67 117.54,26.67 122.87,32 v122.95,32
  Bottom 0.305: K2.1 124.6,30.61 123.2,32 v122.95,32
S3  (via drill 0.35)
  Top 0.305: v123.02,30.43 122,30.43 113.98,22.41 107.67,22.41 107.6,22.35 98.74,22.35 98.74,22.36 98.73,22.35 98.49,22.35 96.9,23.94 U$3.S3
  Bottom 0.305: K3.1 125.03,28.42 v123.02,30.43
S4  (via drill 0.35)
  Top 0.305: v123,28.98 122.91,29.07 121.44,29.07 118.04,25.68 118.04,23.27 114.41,19.63 114.36,19.69 93.43,19.69 92.38,20.73 92.38,21.94 U$3.S4
  Bottom 0.305: K4.1 126.02,25.96 v123,28.98
S5  (via drill 0.35)
  Top 0.305: U$3.S5 91.34,20.9 | 91.34,20.9 91.35,20.89 91.35,20.36 | 91.35,20.36 91.6,20.11 91.59,20.1 94.55,17.14 100.9,17.14 105.33,12.71 112.31,12.71 113.77,11.25 v117.23,11.25 | 91.35,20.36 91.34,20.37 91.34,20.9
  Bottom 0.305: K5.1 125.35,11.25 v117.23,11.25
S6  (via drill 0.35)
  Top 0.305: v120.61,7.85 118.62,9.83 95.11,9.83 92.9,12.04 92.9,17.27 89.34,20.83 U$3.S7
  Bottom 0.305: K6.1 124.27,7.87 124.29,7.85 v120.61,7.85
S7  (via drill 0.35)
  Top 0.305: v120.63,6.58 120.4,6.58 117.66,9.32 93.99,9.32 90.4,12.91 90.4,17.99 88.34,20.05 U$3.S8
  Bottom 0.305: v120.63,6.58 125.45,6.58 K7.1
S8  (via drill 0.35)
  Top 0.305: U$3.S9 87.34,19.56 88.3,18.6 88.3,12.16 93.91,6.55 119.22,6.55 v120.56,5.21
  Bottom 0.305: K8.1 125.07,4.7 121.07,4.7 v120.56,5.21
S9  (via drill 0.35)
  Top 0.305: U$3.S10 86.34,19.12 85.79,18.57 85.79,8.38 83.5,6.1 v57.47,6.1
  Bottom 0.305: v57.47,6.1 55.43,6.1 54.42,5.08 K9.1
S10  (via drill 0.35)
  Top 0.305: v56.7,7.75 58.86,7.75 67.07,15.95 76.57,15.95 79.16,18.54 83.17,18.54 85.34,20.71 U$3.S11
  Bottom 0.305: v56.7,7.75 56.58,7.87 K15.1
S11  (via drill 0.35)
  Top 0.305: U$3.S13 82.01,25.44 79.69,23.11 79.69,19.84 76.48,16.64 65.35,16.64 58.87,10.16 v56.83,10.16
  Bottom 0.305: v56.83,10.16 K14.1
S12  (via drill 0.35)
  Top 0.305: v56.7,12.7 59.62,12.7 66.74,19.81 72.58,19.81 73.34,20.57 77.15,20.57 78.42,21.84 78.42,23.49 81.37,26.44 U$3.S14
  Bottom 0.305: v56.7,12.7 K13.1
S13  (via drill 0.35)
  Top 0.305: v56.58,31.37 57.72,31.37 65.72,23.37 76.63,23.37 80.7,27.44 U$3.S15
  Bottom 0.305: v56.58,31.37 56.48,31.46 K16.1
S14  (via drill 0.35)
  Top 0.305: U$3.S16 80.41,28.44 79.58,27.61 77.58,27.61 76.34,26.37 65.42,26.37 57.92,33.86 56.75,33.86 v56.7,33.91
  Bottom 0.305: v56.7,33.91 56.5,34.12 K12.1
S15  (via drill 0.35)
  Top 0.305: v56.58,36.58 60.64,36.58 67.78,29.44 U$3.S17
  Bottom 0.305: K11.1 56.56,36.59 v56.58,36.58
SWITCH_TEMP  (via drill 0.35)
  Top 0.305: U$3.GPIO9 96.03,30.94 98.6,33.51 v98.6,36.12 98.6,38.4 K17.1 | DEMUX2.1 129.71,41.76 129.98,42.04 v129.98,43.31 | DEMUX1.1 164.47,37.41 167.48,40.42 v167.48,43.53
  Bottom 0.305: v98.6,36.12 100.13,36.12 104.67,31.58 120.11,31.58 124.14,35.61 124.14,41.4 126.05,43.31 v129.98,43.31 130.49,43.81 163.38,43.81 163.67,43.53 v167.48,43.53
T1  (via drill 0.35)
  Top 0.305: E21.2 v107.4,36.3 106.94,36.3 97.57,26.92 94.8,26.92 U$3.GPIO1
  Bottom 0.305: T21.1 108.79,36.29 v107.41,36.29 v107.4,36.3
T2  (via drill 0.35)
  Top 0.305: U$3.GPIO2 97.39,27.44 107.54,37.59 107.54,38.92 v107.57,38.95 107.68,39.06 E20.2
  Bottom 0.305: T20.1 v107.57,38.95
T3  (via drill 0.35)
  Top 0.305: U$3.GPIO3 97.1,27.94 106.73,37.56 106.73,40.96 v107.49,41.72 107.5,41.73 E19.2
  Bottom 0.305: T19.1 108.9,41.72 v107.49,41.72
T4  (via drill 0.35)
  Top 0.305: E18.2 107.78,44.48 v107.38,44.07 106.2,42.89 106.2,37.64 96.99,28.44 U$3.GPIO4
  Bottom 0.305: T18.1 108.89,44.07 v107.38,44.07
T5  (via drill 0.35)
  Top 0.305: E22.2 109.34,50.32 107.3,50.32 v107.2,50.22 105.49,48.5 105.49,37.72 96.7,28.94 U$3.GPIO5
  Bottom 0.305: T22.1 107.3,50.32 v107.2,50.22
T6  (via drill 0.35)
  Top 0.305: E23.2 107.02,52.65 v107.01,52.67 104.58,50.24 104.58,37.56 96.49,29.47 94.83,29.47 U$3.GPIO6
  Bottom 0.305: T23.1 107.02,52.68 v107.01,52.67
T7  (via drill 0.35)
  Top 0.305: U$3.GPIO7 96.29,29.93 103.78,37.43 103.78,51.92 106.73,54.86 106.76,54.86 v106.98,55.08 107.07,55.17 E24.2
  Bottom 0.305: T24.1 107.1,55.19 v106.98,55.08
T8  (via drill 0.35)
  Top 0.305: E25.2 107,57.84 v106.92,57.76 103.09,53.93 103.09,37.39 96.21,30.5 94.86,30.5 U$3.GPIO8
  Bottom 0.305: v106.92,57.76 107.1,57.58 T25.1
TEMP1
  Top 0.305: E21.1 113.98,36.3 RN2.2 115.25,36.3 129.43,36.3 130.21,37.07 130.21,39.03 129.41,39.83 128.68,39.83 DEMUX2.4
TEMP2
  Top 0.305: E20.1 111.78,38.81 113.95,38.81 RN2.3 118.7,39.47 120.25,37.92 DEMUX2.7
TEMP3  (via drill 0.35)
  Top 0.305: E19.1 114.34,41.73 RN2.4 | DEMUX2.9 134.24,37.42 136.84,37.42 139.51,40.09 v139.51,44.58
  Bottom 0.305: v139.51,44.58 139.25,44.32 116.93,44.32 RN2.4
TEMP4  (via drill 0.35)
  Top 0.305: E18.1 114.54,44.48 RN2.5 | DEMUX2.12 132.69,39.2 132.01,39.88 v132.01,45.72
  Bottom 0.305: v132.01,45.72 115.78,45.72 RN2.5
TEMP5  (via drill 0.35)
  Top 0.305: RN3.2 114.59,50.06 E22.1 | DEMUX1.4 163.98,39.33 165.8,41.15 v165.8,45.47
  Bottom 0.305: RN3.2 117.66,46.99 164.27,46.99 v165.8,45.47
TEMP6  (via drill 0.35)
  Top 0.305: RN3.3 114.54,52.65 E23.1 | DEMUX1.7 161.67,41.26 162.66,41.26 163.26,41.86 v163.26,47.75
  Bottom 0.305: RN3.3 119.44,47.75 v163.26,47.75
TEMP7  (via drill 0.35)
  Top 0.305: E24.1 114.56,55.17 RN3.4 120.46,49.28 v120.46,46.36 | DEMUX1.9 157.39,41.89 157.67,42.16 157.67,44.45 v156.4,45.72
  Bottom 0.305: v156.4,45.72 155.76,46.36 v120.46,46.36
TEMP8  (via drill 0.35)
  Top 0.305: E25.1 114.44,57.84 RN3.5 114.74,57.78 116.01,57.78 117.03,56.77 117.03,53.85 122.62,48.26 v122.62,45.09 | DEMUX1.12 156.08,40.11 153.65,40.11 152.33,41.43 v152.33,45.34
  Bottom 0.305: v152.33,45.34 133.28,45.34 132.9,44.96 122.74,44.96 v122.62,45.09
VP
  Top 0.406: POWER.1 77.71,40.72 R161.2
  Bottom 0.406: POWER.1 81.09,48.26 R157.2
VREF1
  Top 0.305: U$3.VREF1 91.84,41.19 82.75,50.28 C175.1 80.62,55.55 TP7.TP
VREF2
  Top 0.305: U$3.VREF2 92.34,41.71 89.14,44.91 89.14,51.17 C177.1 89.12,55.08 87.16,57.05 TP1.TP
  Bottom 0.305: RN2.1 114.08,34.39 112.63,35.84 112.63,45.52 RN3.1 113.78,47.5 112.73,48.54 112.73,48.89 112.61,49.02 112.61,57.66 111.69,58.57 85.02,58.57 TP1.TP
VREG  (via drill 0.35)
  Top 0.305: 90.58,35.03 90.58,40.95 R162.2 77.15,55.28 77.15,55.33 | 90.58,35.03 90.83,35.03 91.34,34.52 U$3.DTEN 91.34,32.42 92.32,31.44 U$3.VREG 95.83,31.44 96.54,32.15 96.54,35.59 R1.2 96.2,38.62 96.2,39.62 97.41,40.83 K17.2 | 90.58,35.03 90.41,35.03 89.84,34.46 U$3.ISOMB | v97.29,42.98 97.88,42.39 K17.2 | K17.2 99.49,40.83 v101.2,39.12 | TP6.TP 77.15,56.24 77.15,55.33 | 77.15,55.33 75.55,53.73 C1.1 | DEMUX1.16 156.17,37.47 152.72,37.47 148.14,42.04 v142.43,42.04 135.95,35.56 v123.12,35.56 | v134.3,43.18 135.44,43.18 135.82,42.8 135.82,42.04 135.55,41.76 DEMUX2.16
  Bottom 0.305: U$2.E 98.16,46.15 97.29,45.29 v97.29,42.98 | v123.12,35.56 120.08,32.51 104.71,32.51 101.2,36.02 v101.2,39.12 | v142.43,42.04 135.44,42.04 v134.3,43.18

### Text on the board
tPlace: HM2100NL
tNames: VREG | VREF2 | 49.9E | GND | TVS | VREF1 | LED | 49.9E | T8 | T7 | T6 | T5 | T4 | T3 | T2 | T1 | T9 | T15 | T14 | T13 | GND | T10 | T11 | T12 | POWER | ON | LV | 100pF | 49.9E | TVS | VP | mm | mm | OFF | mm | mm | HV | 100nF | 10nF | 100nF | C15 | 10nF | C15 | C14 | C14 | 10nF | 100nF | C13 | GND | C13 | C12 | 10nF | C1 | C0 | 10nF | C2 | C1 | C12 | 100nF | 10nF | C11 | 100nF | C11 | 10nF | C2 | C3 | C10 | 100nF | C8 | C4 | C3 | 10nF | C9 | C7 | C5 | 100nF | C4 | C9 | 10nF | 100nF | C5 | C8 | 100nF | 10nF | C6 | 100nF | 10nF | C7 | 100nF | 100nF | 10nF | 10nF | 10nF | 10nF | 100nF | 100nF | 100nF | Designed By Ruchi And Manya
bNames: 100E | 100nF | 1k | C | 100E | C | 10nF | 3.3K | C | C | 100E | 100E | C | 100E | C | C | C | 100E | C | 100E | C | C | C | C | C | 100E | 100E | C | 100E | 100E | 100E | 100E | 100E | 100E | 3.3K | 3.3K | 100E | 3.3K
bValues: DXT555 | 1k